# EasyEDA Pro project NI接口485_测试板子.eprj

# Schematic Schematic1
Create Date: 2023-08-04; Page Name: 接转接板; Project Name: NI接口485_测试板子; Schematic Name: Schematic1; Update Date: 2023-08-05; Company: 嘉立创EDA; Page Size: A4; Version: V1.0
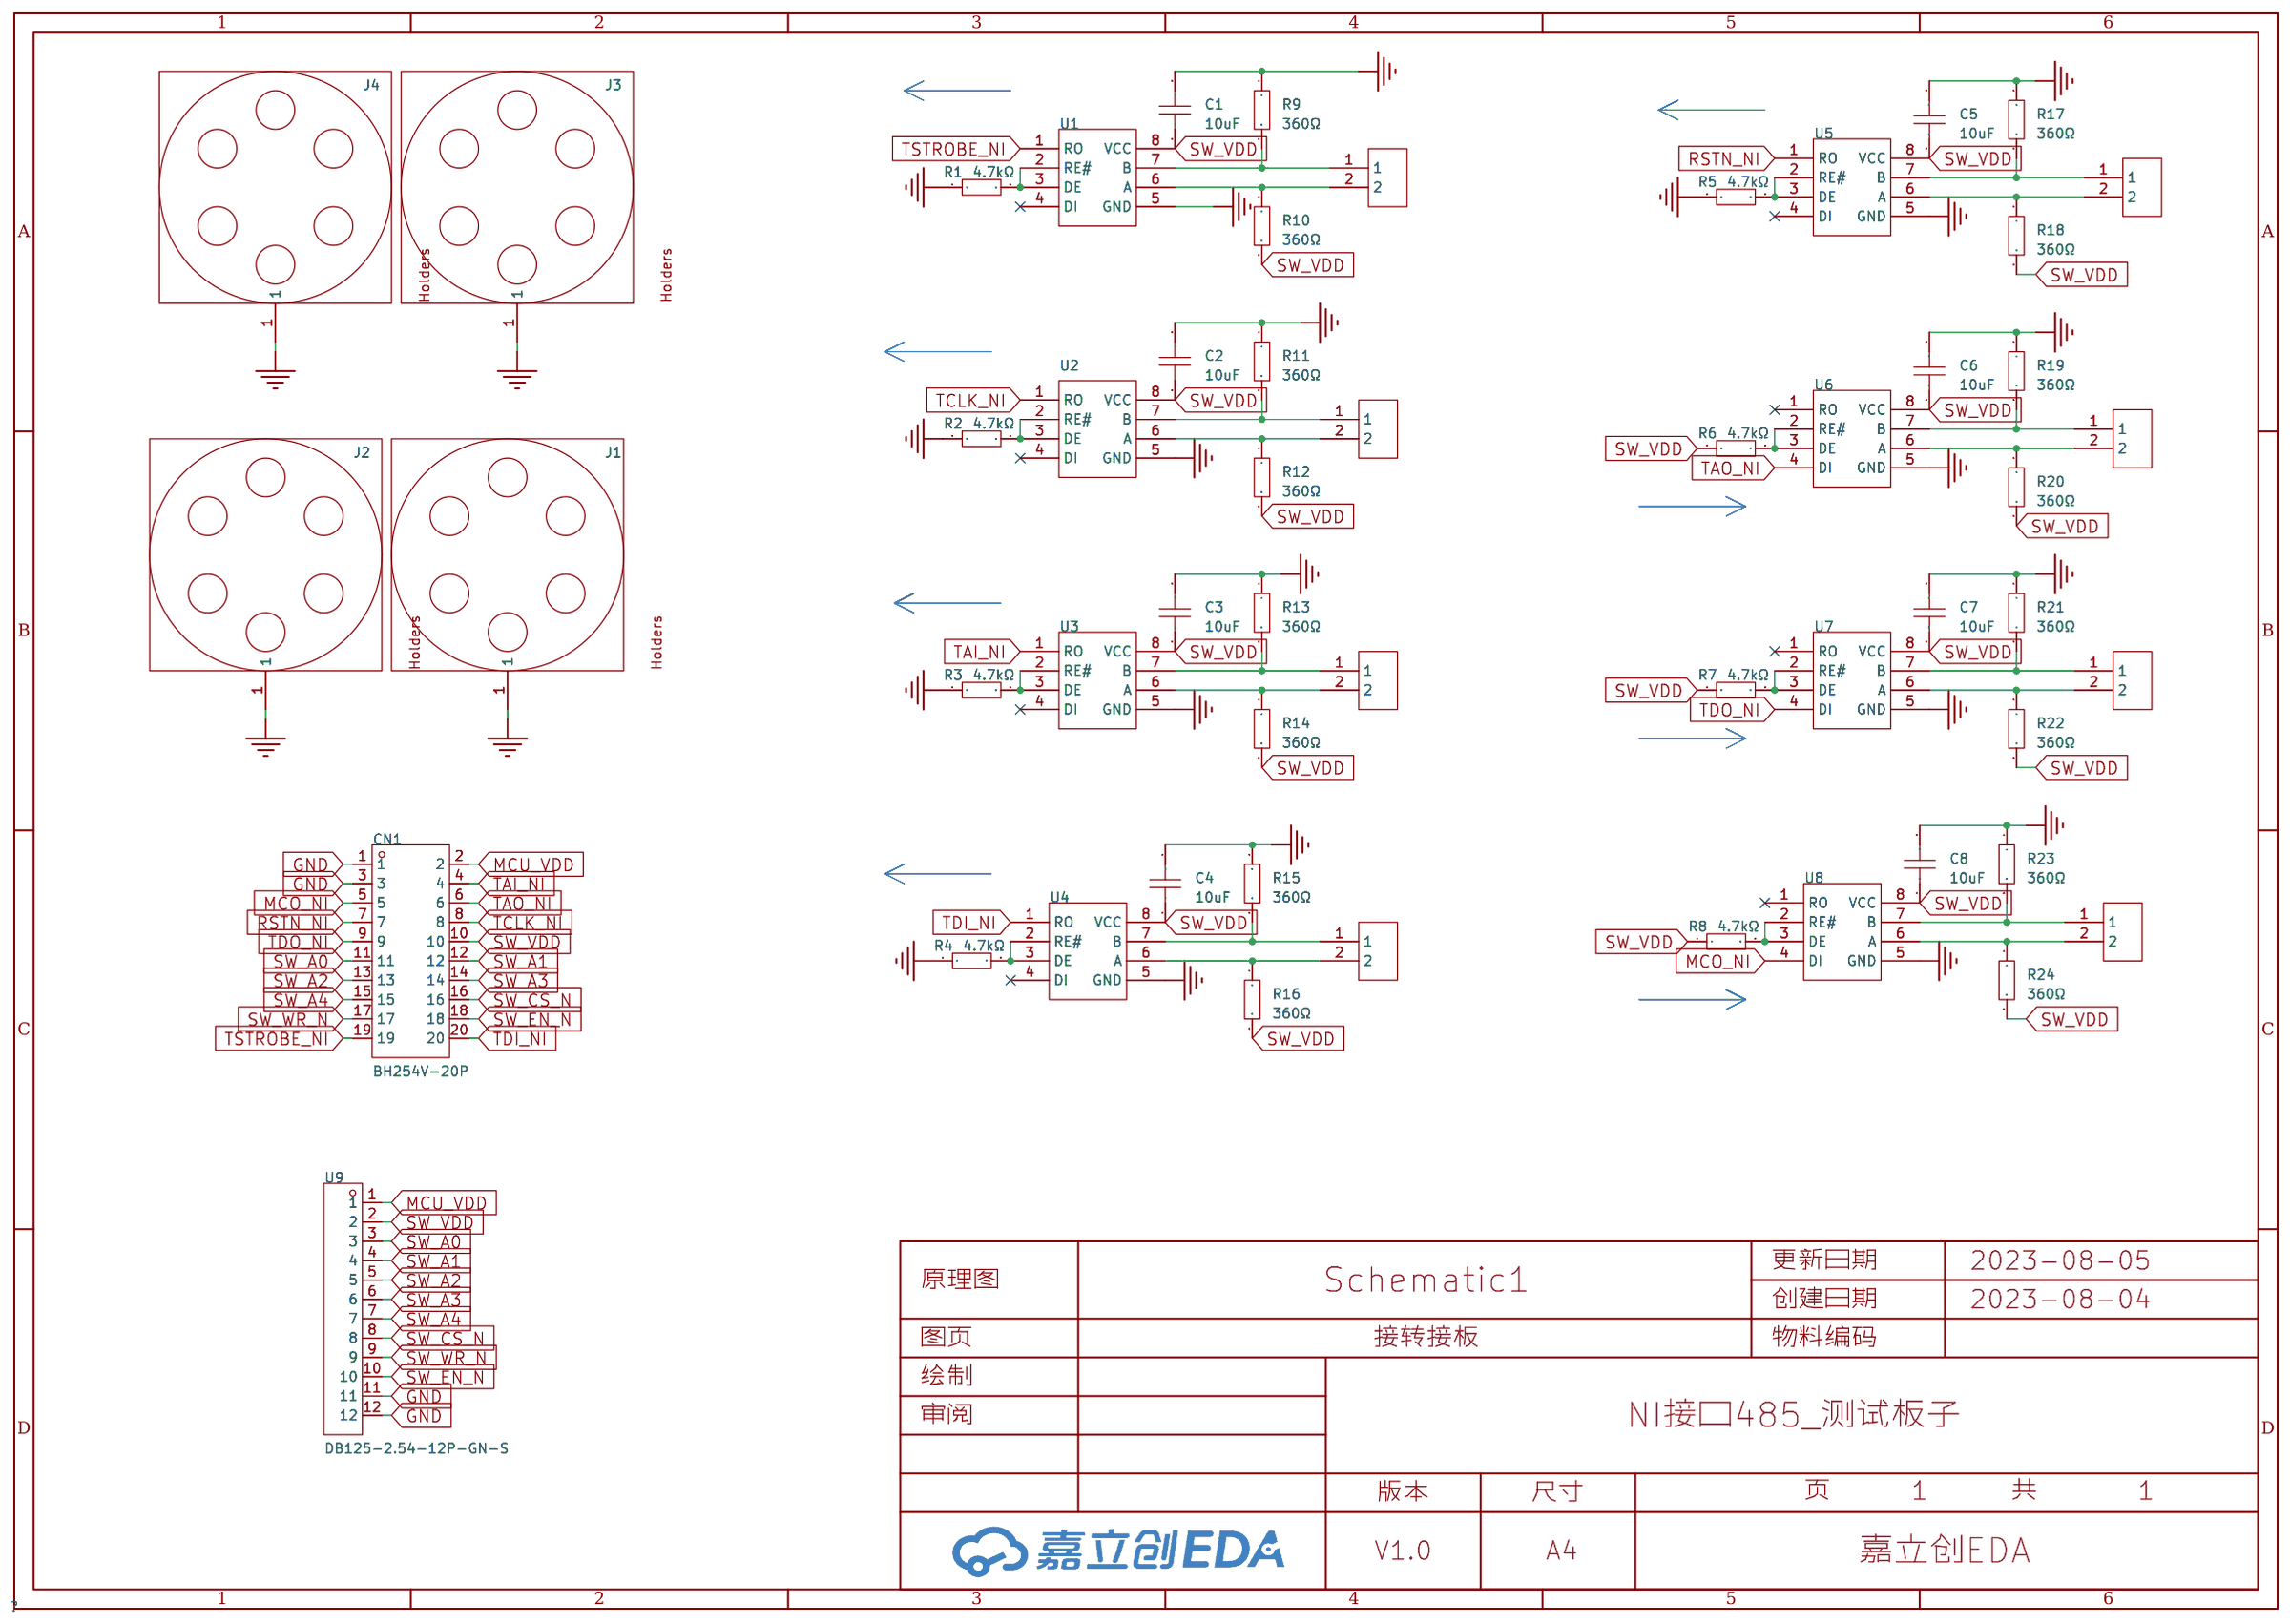
[diagram p0: schematic sheet]

## Parts
C1  10uF  [C0603]
C2  10uF  [C0603]
C3  10uF  [C0603]
C4  10uF  [C0603]
C5  10uF  [C0603]
C6  10uF  [C0603]
C7  10uF  [C0603]
C8  10uF  [C0603]
CN1  BH254V-20P  [CONN-TH_20P-P2.54_0702462001]
J1  -  [DEMO板安装孔]
J2  -  [DEMO板安装孔]
J3  -  [DEMO板安装孔]
J4  -  [DEMO板安装孔]
P1  WJ500V-5.08-2P  [CONN-TH_2P-P5.00_WJ500V-5.08-2P]
P2  WJ500V-5.08-2P  [CONN-TH_2P-P5.00_WJ500V-5.08-2P]
P3  WJ500V-5.08-2P  [CONN-TH_2P-P5.00_WJ500V-5.08-2P]
P4  WJ500V-5.08-2P  [CONN-TH_2P-P5.00_WJ500V-5.08-2P]
P5  WJ500V-5.08-2P  [CONN-TH_2P-P5.00_WJ500V-5.08-2P]
P6  WJ500V-5.08-2P  [CONN-TH_2P-P5.00_WJ500V-5.08-2P]
P7  WJ500V-5.08-2P  [CONN-TH_2P-P5.00_WJ500V-5.08-2P]
P8  WJ500V-5.08-2P  [CONN-TH_2P-P5.00_WJ500V-5.08-2P]
R1  4.7kΩ  [R0805]
R2  4.7kΩ  [R0805]
R3  4.7kΩ  [R0805]
R4  4.7kΩ  [R0805]
R5  4.7kΩ  [R0805]
R6  4.7kΩ  [R0805]
R7  4.7kΩ  [R0805]
R8  4.7kΩ  [R0805]
R9  360Ω  [R0603]
R10  360Ω  [R0603]
R11  360Ω  [R0603]
R12  360Ω  [R0603]
R13  360Ω  [R0603]
R14  360Ω  [R0603]
R15  360Ω  [R0603]
R16  360Ω  [R0603]
R17  360Ω  [R0603]
R18  360Ω  [R0603]
R19  360Ω  [R0603]
R20  360Ω  [R0603]
R21  360Ω  [R0603]
R22  360Ω  [R0603]
R23  360Ω  [R0603]
R24  360Ω  [R0603]
U1  SP485EEN-L/TR  [SOIC-8_L5.0-W4.0-P1.27-LS6.0-BL]
U2  SP485EEN-L/TR  [SOIC-8_L5.0-W4.0-P1.27-LS6.0-BL]
U3  SP485EEN-L/TR  [SOIC-8_L5.0-W4.0-P1.27-LS6.0-BL]
U4  SP485EEN-L/TR  [SOIC-8_L5.0-W4.0-P1.27-LS6.0-BL]
U5  SP485EEN-L/TR  [SOIC-8_L5.0-W4.0-P1.27-LS6.0-BL]
U6  SP485EEN-L/TR  [SOIC-8_L5.0-W4.0-P1.27-LS6.0-BL]
U7  SP485EEN-L/TR  [SOIC-8_L5.0-W4.0-P1.27-LS6.0-BL]
U8  SP485EEN-L/TR  [SOIC-8_L5.0-W4.0-P1.27-LS6.0-BL]
U9  DB125-2.54-12P-GN-S  [CONN-TH_DB125-2.54-12P-GN]

## Library data of the parts
C1-C8 = CL10A106KP8NNNC: 容值:10uF;精度:±10%;额定电压:10V;材质(温度系数):X5R;; LCSC Part Name: 10uF ±10% 10V; Supplier Part: C19702; Manufacturer: SAMSUNG(三星); Supplier Footprint: 0603; JLCPCB Part Class: Basic Part; Datasheet: https://atta.szlcsc.com/upload/public/pdf/source/20160103/1457707703378.pdf; Supplier: LCSC; Tolerance: ±10%; Voltage Rated: 10V; Temperature Coefficient: X5R
CN1 = BH254V-20P: 连接器类型:简牛座;每排PIN数:10;结构:2x10P;排数:2;间距:2.54mm;行距:2.54mm;封装形式:直插;额定电流:3A;额定电压:250V;工作温度范围:-40℃~+105℃;; LCSC Part Name: 每排P数:10 2x10P 排数:2 2.54mm; Supplier Part: C492444; Manufacturer: XFCN(兴飞); Supplier Footprint: 插件,P=2.54mm; JLCPCB Part Class: Extended Part; Datasheet: https://atta.szlcsc.com/upload/public/pdf/source/20200312/C492444_4AABE2FC4F6BE8226B85135616AF0092.pdf; Supplier: LCSC; Connector Type: 简牛座; Pin Number in each Row: 10; Structure: 2x10P; Number of Rows: 2; Pitch: 2.54mm; Row Spacing: 2.54mm; Holder Type: 直插; Current Rating (Max): 3A; Voltage Rating (Max): 250V; Operating Temperature Range: -40℃~+105℃
J1-J4 = 螺孔_3.1X6MM
P1-P8 = WJ500V-5.08-2P: 间距:5.08mm;结构:1x2P;排数:1;每排PIN数:2;安装方式:直针;额定电流:18A;额定电压:250V;线规 - AWG:14~30;线规 - mm2:2.5;工作温度范围:-40℃~+105℃;颜色:绿色;; LCSC Part Name: 5.08mm 1x2P 排数:1 每排P数:2 直针 可拼接; Supplier Part: C8465; Manufacturer: KANGNEX(康奈克斯电气); Supplier Footprint: 插件,P=5.08mm; JLCPCB Part Class: Extended Part; Datasheet: https://atta.szlcsc.com/upload/public/pdf/source/20191225/C8465_02D34CE5B5B4A53DF5891601D97FA9F4.pdf; Supplier: LCSC; Pitch: 5.08mm; Structure: 1x2P; Number of Rows: 1; Number of PINs Per Row: 2; Mounting Style: 直针; Current Rating (Max): 18A; Voltage Rating (Max): 250V; Wire Gauge - AWG: 14~30; Wire Gauge - mm2: 2.5; Operating Temperature Range: -40℃~+105℃; Color: 绿色
R1-R8 = 0805W8F4701T5E: 电阻类型:厚膜电阻;阻值:4.7kΩ;精度:±1%;功率:125mW;; LCSC Part Name: 4.7kΩ ±1% 125mW; Supplier Part: C17673; Manufacturer: UNI-ROYAL(厚声); Supplier Footprint: 0805; JLCPCB Part Class: Basic Part; Datasheet: https://atta.szlcsc.com/upload/public/pdf/source/20200306/C422600_1E6D84923E4A46A82E41ADD87F860B5C.pdf; Supplier: LCSC; Type: 厚膜电阻; Tolerance: ±1%; Power(Watts): 125mW; Temperature Coefficient: ±100ppm/℃; Overload Voltage (Max): 150V; Operating Temperature Range: -55℃~+155℃
R9-R24 = 0603WAF3600T5E: 电阻类型:厚膜电阻;阻值:360Ω;精度:±1%;功率:100mW;; LCSC Part Name: 360Ω ±1% 100mW; Supplier Part: C25194; Manufacturer: UNI-ROYAL(厚声); Supplier Footprint: 0603; JLCPCB Part Class: Basic Part; Datasheet: https://atta.szlcsc.com/upload/public/pdf/source/20200306/C422600_1E6D84923E4A46A82E41ADD87F860B5C.pdf; Supplier: LCSC; Type: 厚膜电阻; Tolerance: ±1%; Power(Watts): 100mW; Temperature Coefficient: ±100ppm/℃; Overload Voltage (Max): 75V; Operating Temperature Range: -55℃~+155℃
U1-U8 = SP485EEN-L/TR: 类型:收发器;驱动器/接收器:1/1;数据速率:10Mbps;; LCSC Part Name: 5V供电 10Mbps 收发器; Supplier Part: C6855; Manufacturer: MaxLinear; Supplier Footprint: SOIC-8; JLCPCB Part Class: Basic Part; Datasheet: https://atta.szlcsc.com/upload/public/pdf/source/20210125/C916163_66C97B5ACCC910994E8B10780F9BD300.pdf; Supplier: LCSC; Types: 收发器; Driver/receiver: 1/1; Data Rate: 10Mbps; Supply Voltage: 4.75V~5.25V
U9 = DB125-2.54-12P-GN-S: 间距:2.54mm;结构:1x12P;排数:1;每排PIN数:12;安装方式:直针;额定电流:8A;额定电压:130V;线规 - AWG:18~26;线规 - mm2:0.5~1;工作温度范围:-40℃~+105℃;颜色:绿色;; LCSC Part Name: 2.54mm 1x12P 排数:1 每排P数:12 直针; Supplier Part: C918129; Manufacturer: DIBO(地博电气); Supplier Footprint: 插件,P=2.54mm; JLCPCB Part Class: Extended Part; Datasheet: https://atta.szlcsc.com/upload/public/pdf/source/20230106/BCD3A0BE1EB95DC3E813F1745F022035.pdf; Supplier: LCSC; Pitch: 2.54mm; Structure: 1x12P; Number of Rows: 1; Number of PINs Per Row: 12; Mounting Style: 直针; Current Rating (Max): 8A; Voltage Rating (Max): 130V; Wire Gauge - AWG: 18~26; Wire Gauge - mm2: 0.5~1; Operating Temperature Range: -40℃~+105℃; Color: 绿色

## Nets
GND: C1.2 C2.2 C3.2 C4.2 C5.2 C6.2 C7.2 C8.2 CN1.1 CN1.3 J1.1 J2.1 J3.1 J4.1 R1.1 R2.1 R3.1 R4.1 R5.1 R9.1 R11.1 R13.1 R15.1 R17.1 R19.1 R21.1 R23.1 U1.5(GND) U2.5(GND) U3.5(GND) U4.5(GND) U5.5(GND) U6.5(GND) U7.5(GND) U8.5(GND) U9.11 U9.12
MCO_NI: CN1.5 U8.4(DI)
MCU_VDD: CN1.2 U9.1
RSTN_NI: CN1.7 U5.1(RO)
SW_A0: CN1.11 U9.3
SW_A1: CN1.12 U9.4
SW_A2: CN1.13 U9.5
SW_A3: CN1.14 U9.6
SW_A4: CN1.15 U9.7
SW_CS_N: CN1.16 U9.8
SW_EN_N: CN1.18 U9.10
SW_VDD: C1.1 C2.1 C3.1 C4.1 C5.1 C6.1 C7.1 C8.1 CN1.10 R6.1 R7.1 R8.1 R10.2 R12.2 R14.2 R16.2 R18.2 R20.2 R22.2 R24.2 U1.8(VCC) U2.8(VCC) U3.8(VCC) U4.8(VCC) U5.8(VCC) U6.8(VCC) U7.8(VCC) U8.8(VCC) U9.2
SW_WR_N: CN1.17 U9.9
TAI_NI: CN1.4 U3.1(RO)
TAO_NI: CN1.6 U6.4(DI)
TCLK_NI: CN1.8 U2.1(RO)
TDI_NI: CN1.20 U4.1(RO)
TDO_NI: CN1.9 U7.4(DI)
TSTROBE_NI: CN1.19 U1.1(RO)
$1N832: R1.2 U1.2(RE#) U1.3(DE)
$1N836: R2.2 U2.2(RE#) U2.3(DE)
$1N843: R3.2 U3.2(RE#) U3.3(DE)
$1N857: R4.2 U4.2(RE#) U4.3(DE)
$1N862: R5.2 U5.2(RE#) U5.3(DE)
$1N867: R6.2 U6.2(RE#) U6.3(DE)
$1N875: R7.2 U7.2(RE#) U7.3(DE)
$1N1426: P1.2 R10.1 U1.6(A)
$1N1466: P5.2 R18.1 U5.6(A)
$1N1479: P6.2 R20.1 U6.6(A)
$1N1489: P7.2 R22.1 U7.6(A)
$1N1503: P8.2 R24.1 U8.6(A)
$1N2683: R8.2 U8.2(RE#) U8.3(DE)
$1N7494: P1.1 R9.2 U1.7(B)
$1N7701: P2.2 R12.1 U2.6(A)
$1N7808: P2.1 R11.2 U2.7(B)
$1N7842: P3.2 R14.1 U3.6(A)
$1N7943: P3.1 R13.2 U3.7(B)
$1N8036: P4.2 R16.1 U4.6(A)
$1N8041: P4.1 R15.2 U4.7(B)
$1N8826: P5.1 R17.2 U5.7(B)
$1N9060: P7.1 R21.2 U7.7(B)
$1N9174: P8.1 R23.2 U8.7(B)
$1N9186: P6.1 R19.2 U6.7(B)

Not connected (* = marked no-connect by the designer): U1 4(DI)*; U2 4(DI)*; U3 4(DI)*; U4 4(DI)*; U5 4(DI)*; U6 1(RO)*; U7 1(RO)*; U8 1(RO)*

# Schematic Schematic2
Create Date: 2023-08-04; Page Name: 接NI; Project Name: NI接口485_测试板子; Schematic Name: Schematic2; Update Date: 2023-08-05; Company: 嘉立创EDA; Page Size: A4; Version: V1.0
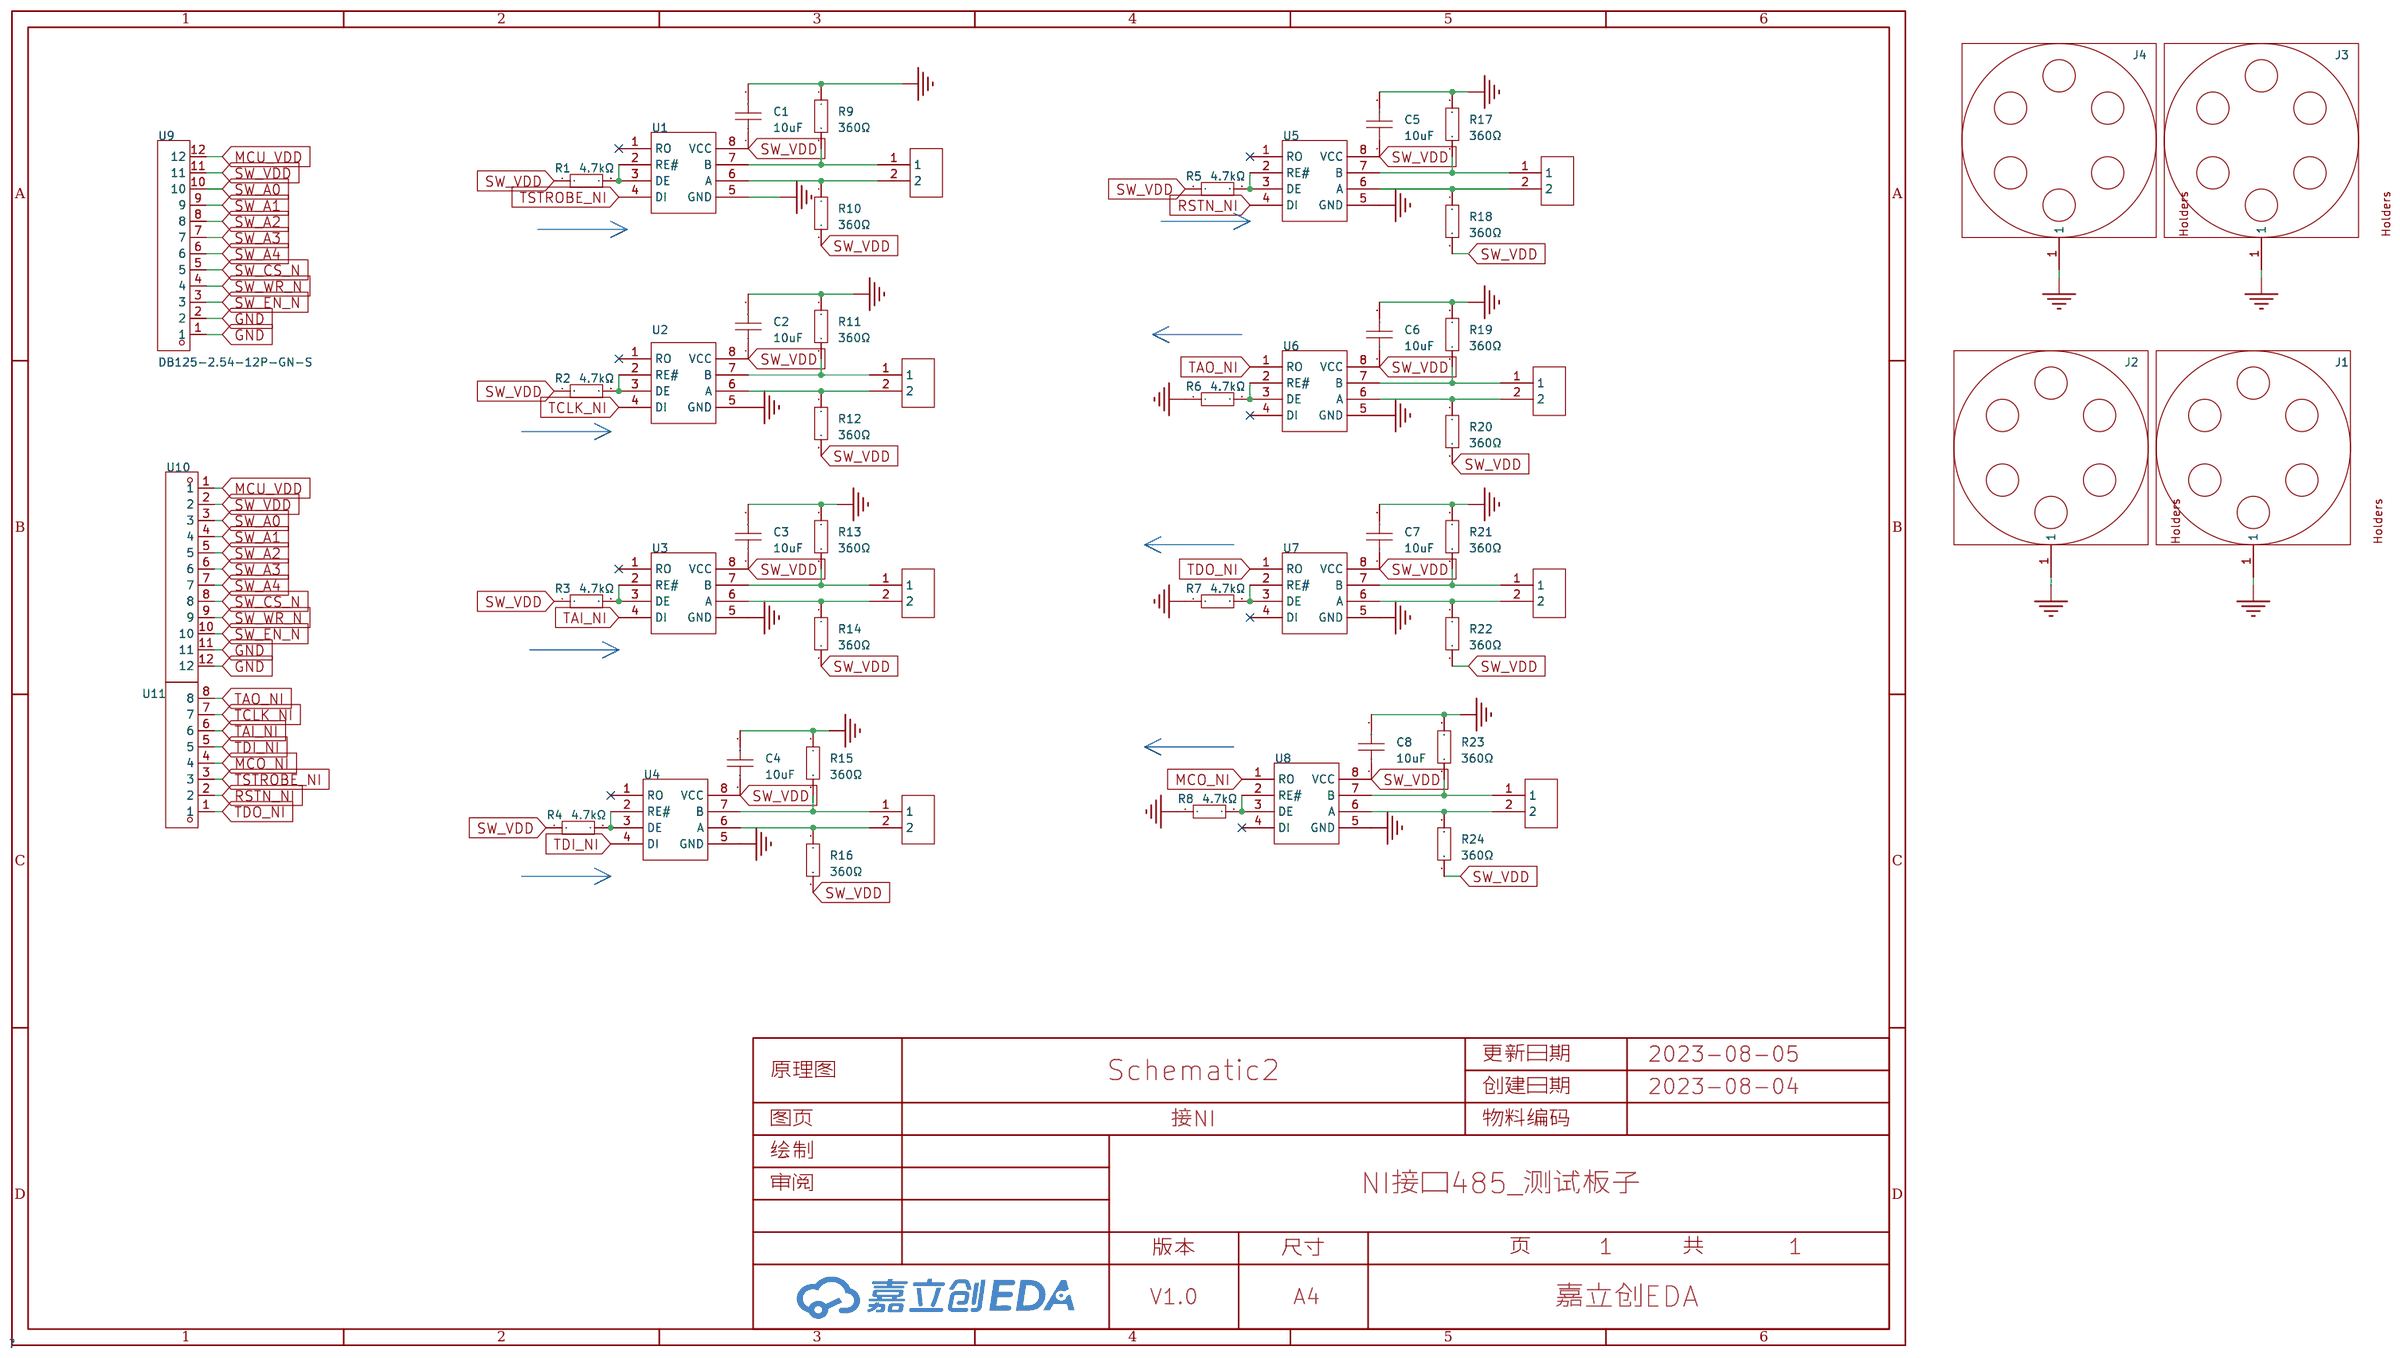
[diagram p1: schematic sheet]

## Parts
C1  10uF  [C0603]
C2  10uF  [C0603]
C3  10uF  [C0603]
C4  10uF  [C0603]
C5  10uF  [C0603]
C6  10uF  [C0603]
C7  10uF  [C0603]
C8  10uF  [C0603]
J1  -  [DEMO板安装孔]
J2  -  [DEMO板安装孔]
J3  -  [DEMO板安装孔]
J4  -  [DEMO板安装孔]
P1  WJ500V-5.08-2P  [CONN-TH_2P-P5.00_WJ500V-5.08-2P]
P2  WJ500V-5.08-2P  [CONN-TH_2P-P5.00_WJ500V-5.08-2P]
P3  WJ500V-5.08-2P  [CONN-TH_2P-P5.00_WJ500V-5.08-2P]
P4  WJ500V-5.08-2P  [CONN-TH_2P-P5.00_WJ500V-5.08-2P]
P5  WJ500V-5.08-2P  [CONN-TH_2P-P5.00_WJ500V-5.08-2P]
P6  WJ500V-5.08-2P  [CONN-TH_2P-P5.00_WJ500V-5.08-2P]
P7  WJ500V-5.08-2P  [CONN-TH_2P-P5.00_WJ500V-5.08-2P]
P8  WJ500V-5.08-2P  [CONN-TH_2P-P5.00_WJ500V-5.08-2P]
R1  4.7kΩ  [R0805]
R2  4.7kΩ  [R0805]
R3  4.7kΩ  [R0805]
R4  4.7kΩ  [R0805]
R5  4.7kΩ  [R0805]
R6  4.7kΩ  [R0805]
R7  4.7kΩ  [R0805]
R8  4.7kΩ  [R0805]
R9  360Ω  [R0603]
R10  360Ω  [R0603]
R11  360Ω  [R0603]
R12  360Ω  [R0603]
R13  360Ω  [R0603]
R14  360Ω  [R0603]
R15  360Ω  [R0603]
R16  360Ω  [R0603]
R17  360Ω  [R0603]
R18  360Ω  [R0603]
R19  360Ω  [R0603]
R20  360Ω  [R0603]
R21  360Ω  [R0603]
R22  360Ω  [R0603]
R23  360Ω  [R0603]
R24  360Ω  [R0603]
U1  SP485EEN-L/TR  [SOIC-8_L5.0-W4.0-P1.27-LS6.0-BL]
U2  SP485EEN-L/TR  [SOIC-8_L5.0-W4.0-P1.27-LS6.0-BL]
U3  SP485EEN-L/TR  [SOIC-8_L5.0-W4.0-P1.27-LS6.0-BL]
U4  SP485EEN-L/TR  [SOIC-8_L5.0-W4.0-P1.27-LS6.0-BL]
U5  SP485EEN-L/TR  [SOIC-8_L5.0-W4.0-P1.27-LS6.0-BL]
U6  SP485EEN-L/TR  [SOIC-8_L5.0-W4.0-P1.27-LS6.0-BL]
U7  SP485EEN-L/TR  [SOIC-8_L5.0-W4.0-P1.27-LS6.0-BL]
U8  SP485EEN-L/TR  [SOIC-8_L5.0-W4.0-P1.27-LS6.0-BL]
U9  DB125-2.54-12P-GN-S  [CONN-TH_DB125-2.54-12P-GN]
U10  DB125-2.54-12P-GN-S  [CONN-TH_DB125-2.54-12P-GN]
U11  DB125-2.54-8P-GN-S  [CONN-TH_DB125-2.54-8P-GN]

## Library data of the parts
C1-C8 = CL10A106KP8NNNC: 容值:10uF;精度:±10%;额定电压:10V;材质(温度系数):X5R;; LCSC Part Name: 10uF ±10% 10V; Supplier Part: C19702; Manufacturer: SAMSUNG(三星); Supplier Footprint: 0603; JLCPCB Part Class: Basic Part; Datasheet: https://atta.szlcsc.com/upload/public/pdf/source/20160103/1457707703378.pdf; Supplier: LCSC; Tolerance: ±10%; Voltage Rated: 10V; Temperature Coefficient: X5R
J1-J4 = 螺孔_3.1X6MM
P1-P8 = WJ500V-5.08-2P: 间距:5.08mm;结构:1x2P;排数:1;每排PIN数:2;安装方式:直针;额定电流:18A;额定电压:250V;线规 - AWG:14~30;线规 - mm2:2.5;工作温度范围:-40℃~+105℃;颜色:绿色;; LCSC Part Name: 5.08mm 1x2P 排数:1 每排P数:2 直针 可拼接; Supplier Part: C8465; Manufacturer: KANGNEX(康奈克斯电气); Supplier Footprint: 插件,P=5.08mm; JLCPCB Part Class: Extended Part; Datasheet: https://atta.szlcsc.com/upload/public/pdf/source/20191225/C8465_02D34CE5B5B4A53DF5891601D97FA9F4.pdf; Supplier: LCSC; Pitch: 5.08mm; Structure: 1x2P; Number of Rows: 1; Number of PINs Per Row: 2; Mounting Style: 直针; Current Rating (Max): 18A; Voltage Rating (Max): 250V; Wire Gauge - AWG: 14~30; Wire Gauge - mm2: 2.5; Operating Temperature Range: -40℃~+105℃; Color: 绿色
R1-R8 = 0805W8F4701T5E: 电阻类型:厚膜电阻;阻值:4.7kΩ;精度:±1%;功率:125mW;; LCSC Part Name: 4.7kΩ ±1% 125mW; Supplier Part: C17673; Manufacturer: UNI-ROYAL(厚声); Supplier Footprint: 0805; JLCPCB Part Class: Basic Part; Datasheet: https://atta.szlcsc.com/upload/public/pdf/source/20200306/C422600_1E6D84923E4A46A82E41ADD87F860B5C.pdf; Supplier: LCSC; Type: 厚膜电阻; Tolerance: ±1%; Power(Watts): 125mW; Temperature Coefficient: ±100ppm/℃; Overload Voltage (Max): 150V; Operating Temperature Range: -55℃~+155℃
R9-R24 = 0603WAF3600T5E: 电阻类型:厚膜电阻;阻值:360Ω;精度:±1%;功率:100mW;; LCSC Part Name: 360Ω ±1% 100mW; Supplier Part: C25194; Manufacturer: UNI-ROYAL(厚声); Supplier Footprint: 0603; JLCPCB Part Class: Basic Part; Datasheet: https://atta.szlcsc.com/upload/public/pdf/source/20200306/C422600_1E6D84923E4A46A82E41ADD87F860B5C.pdf; Supplier: LCSC; Type: 厚膜电阻; Tolerance: ±1%; Power(Watts): 100mW; Temperature Coefficient: ±100ppm/℃; Overload Voltage (Max): 75V; Operating Temperature Range: -55℃~+155℃
U1-U8 = SP485EEN-L/TR: 类型:收发器;驱动器/接收器:1/1;数据速率:10Mbps;; LCSC Part Name: 5V供电 10Mbps 收发器; Supplier Part: C6855; Manufacturer: MaxLinear; Supplier Footprint: SOIC-8; JLCPCB Part Class: Basic Part; Datasheet: https://atta.szlcsc.com/upload/public/pdf/source/20210125/C916163_66C97B5ACCC910994E8B10780F9BD300.pdf; Supplier: LCSC; Types: 收发器; Driver/receiver: 1/1; Data Rate: 10Mbps; Supply Voltage: 4.75V~5.25V
U9 U10 = DB125-2.54-12P-GN-S: 间距:2.54mm;结构:1x12P;排数:1;每排PIN数:12;安装方式:直针;额定电流:8A;额定电压:130V;线规 - AWG:18~26;线规 - mm2:0.5~1;工作温度范围:-40℃~+105℃;颜色:绿色;; LCSC Part Name: 2.54mm 1x12P 排数:1 每排P数:12 直针; Supplier Part: C918129; Manufacturer: DIBO(地博电气); Supplier Footprint: 插件,P=2.54mm; JLCPCB Part Class: Extended Part; Datasheet: https://atta.szlcsc.com/upload/public/pdf/source/20230106/BCD3A0BE1EB95DC3E813F1745F022035.pdf; Supplier: LCSC; Pitch: 2.54mm; Structure: 1x12P; Number of Rows: 1; Number of PINs Per Row: 12; Mounting Style: 直针; Current Rating (Max): 8A; Voltage Rating (Max): 130V; Wire Gauge - AWG: 18~26; Wire Gauge - mm2: 0.5~1; Operating Temperature Range: -40℃~+105℃; Color: 绿色
U11 = DB125-2.54-8P-GN-S: 间距:2.54mm;排数:1;每排PIN数:8;安装方式:直针;额定电流:8A;额定电压:130V;线规 - AWG:18~26;线规 - mm?:0.5~1;工作温度范围:-40℃~+105℃;颜色:绿色;; LCSC Part Name: 2.54mm 排数:1 每排P数:8 直针; Supplier Part: C918126; Manufacturer: DIBO(地博电气); Supplier Footprint: 直插,P=2.54mm; JLCPCB Part Class: Extended Part; Datasheet: https://atta.szlcsc.com/upload/public/pdf/source/20201111/C918120_C9DB7F6F3DB366529A80D61CABEEDAE6.pdf; Supplier: LCSC; Pitch: 2.54mm; Number of Rows: 1; Number of PINs Per Row: 8; Mounting Style: 直针; Current Rating (Max): 8A; Voltage Rating (Max): 130V; Wire Gauge - AWG: 18~26; Wire Gauge - mm?: 0.5~1; Operating Temperature Range: -40℃~+105℃; Color: 绿色

## Nets
GND: C1.2 C2.2 C3.2 C4.2 C5.2 C6.2 C7.2 C8.2 J1.1 J2.1 J3.1 J4.1 R6.1 R7.1 R8.1 R9.1 R11.1 R13.1 R15.1 R17.1 R19.1 R21.1 R23.1 U1.5(GND) U2.5(GND) U3.5(GND) U4.5(GND) U5.5(GND) U6.5(GND) U7.5(GND) U8.5(GND) U9.1 U9.2 U10.11 U10.12
MCO_NI: U8.1(RO) U11.4
MCU_VDD: U9.12 U10.1
RSTN_NI: U5.4(DI) U11.2
SW_A0: U9.10 U10.3
SW_A1: U9.9 U10.4
SW_A2: U9.8 U10.5
SW_A3: U9.7 U10.6
SW_A4: U9.6 U10.7
SW_CS_N: U9.5 U10.8
SW_EN_N: U9.3 U10.10
SW_VDD: C1.1 C2.1 C3.1 C4.1 C5.1 C6.1 C7.1 C8.1 R1.1 R2.1 R3.1 R4.1 R5.1 R10.2 R12.2 R14.2 R16.2 R18.2 R20.2 R22.2 R24.2 U1.8(VCC) U2.8(VCC) U3.8(VCC) U4.8(VCC) U5.8(VCC) U6.8(VCC) U7.8(VCC) U8.8(VCC) U9.11 U10.2
SW_WR_N: U9.4 U10.9
TAI_NI: U3.4(DI) U11.6
TAO_NI: U6.1(RO) U11.8
TCLK_NI: U2.4(DI) U11.7
TDI_NI: U4.4(DI) U11.5
TDO_NI: U7.1(RO) U11.1
TSTROBE_NI: U1.4(DI) U11.3
$1N12065: R1.2 U1.2(RE#) U1.3(DE)
$1N12066: R2.2 U2.2(RE#) U2.3(DE)
$1N12067: R3.2 U3.2(RE#) U3.3(DE)
$1N12068: R4.2 U4.2(RE#) U4.3(DE)
$1N12069: R6.2 U6.2(RE#) U6.3(DE)
$1N12070: R7.2 U7.2(RE#) U7.3(DE)
$1N12071: P6.2 R20.1 U6.6(A)
$1N12074: P7.2 R22.1 U7.6(A)
$1N12077: P8.2 R24.1 U8.6(A)
$1N12080: R8.2 U8.2(RE#) U8.3(DE)
$1N12109: P1.1 R9.2 U1.7(B)
$1N12117: P1.2 R10.1 U1.6(A)
$1N12129: P2.2 R12.1 U2.6(A)
$1N12137: P2.1 R11.2 U2.7(B)
$1N12145: P3.2 R14.1 U3.6(A)
$1N12153: P3.1 R13.2 U3.7(B)
$1N12161: P5.2 R18.1 U5.6(A)
$1N12164: R5.2 U5.2(RE#) U5.3(DE)
$1N12169: P4.2 R16.1 U4.6(A)
$1N12172: P4.1 R15.2 U4.7(B)
$1N12187: P5.1 R17.2 U5.7(B)
$1N12210: P7.1 R21.2 U7.7(B)
$1N12222: P8.1 R23.2 U8.7(B)
$1N12229: P6.1 R19.2 U6.7(B)

Not connected (* = marked no-connect by the designer): U1 1(RO)*; U2 1(RO)*; U3 1(RO)*; U4 1(RO)*; U5 1(RO)*; U6 4(DI)*; U7 4(DI)*; U8 4(DI)*

# Board PCB1
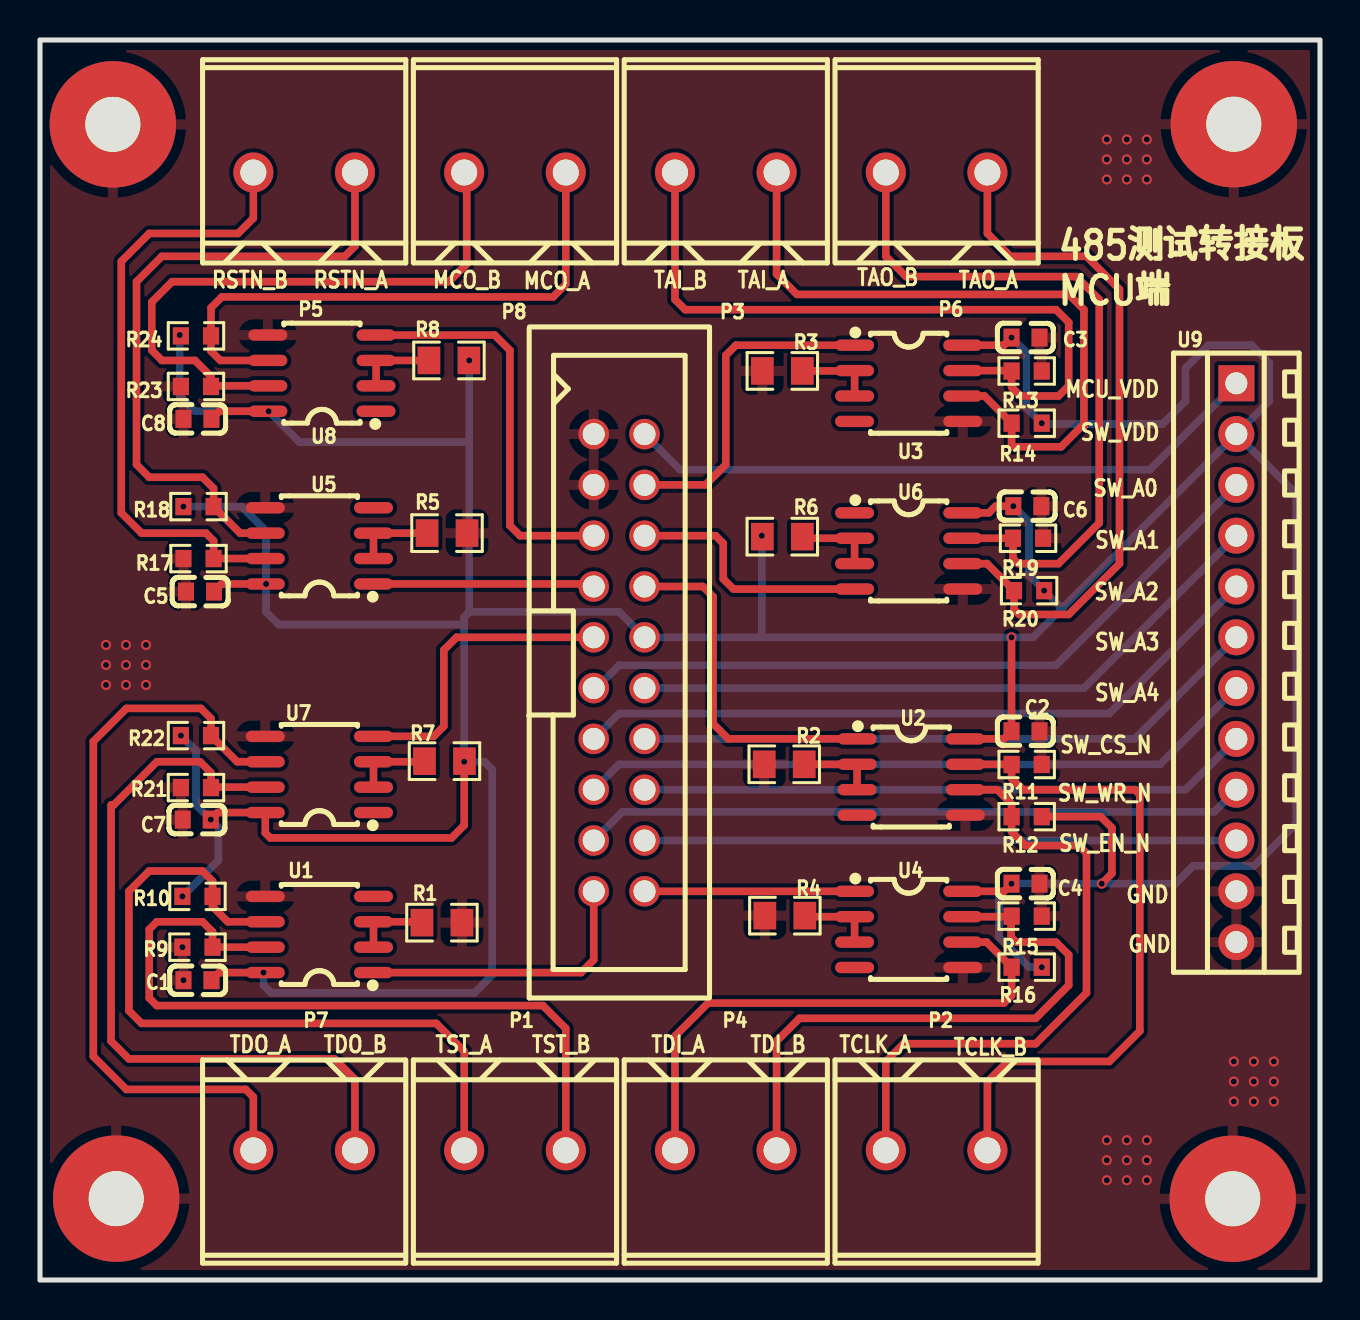
[diagram p2: board, top side]
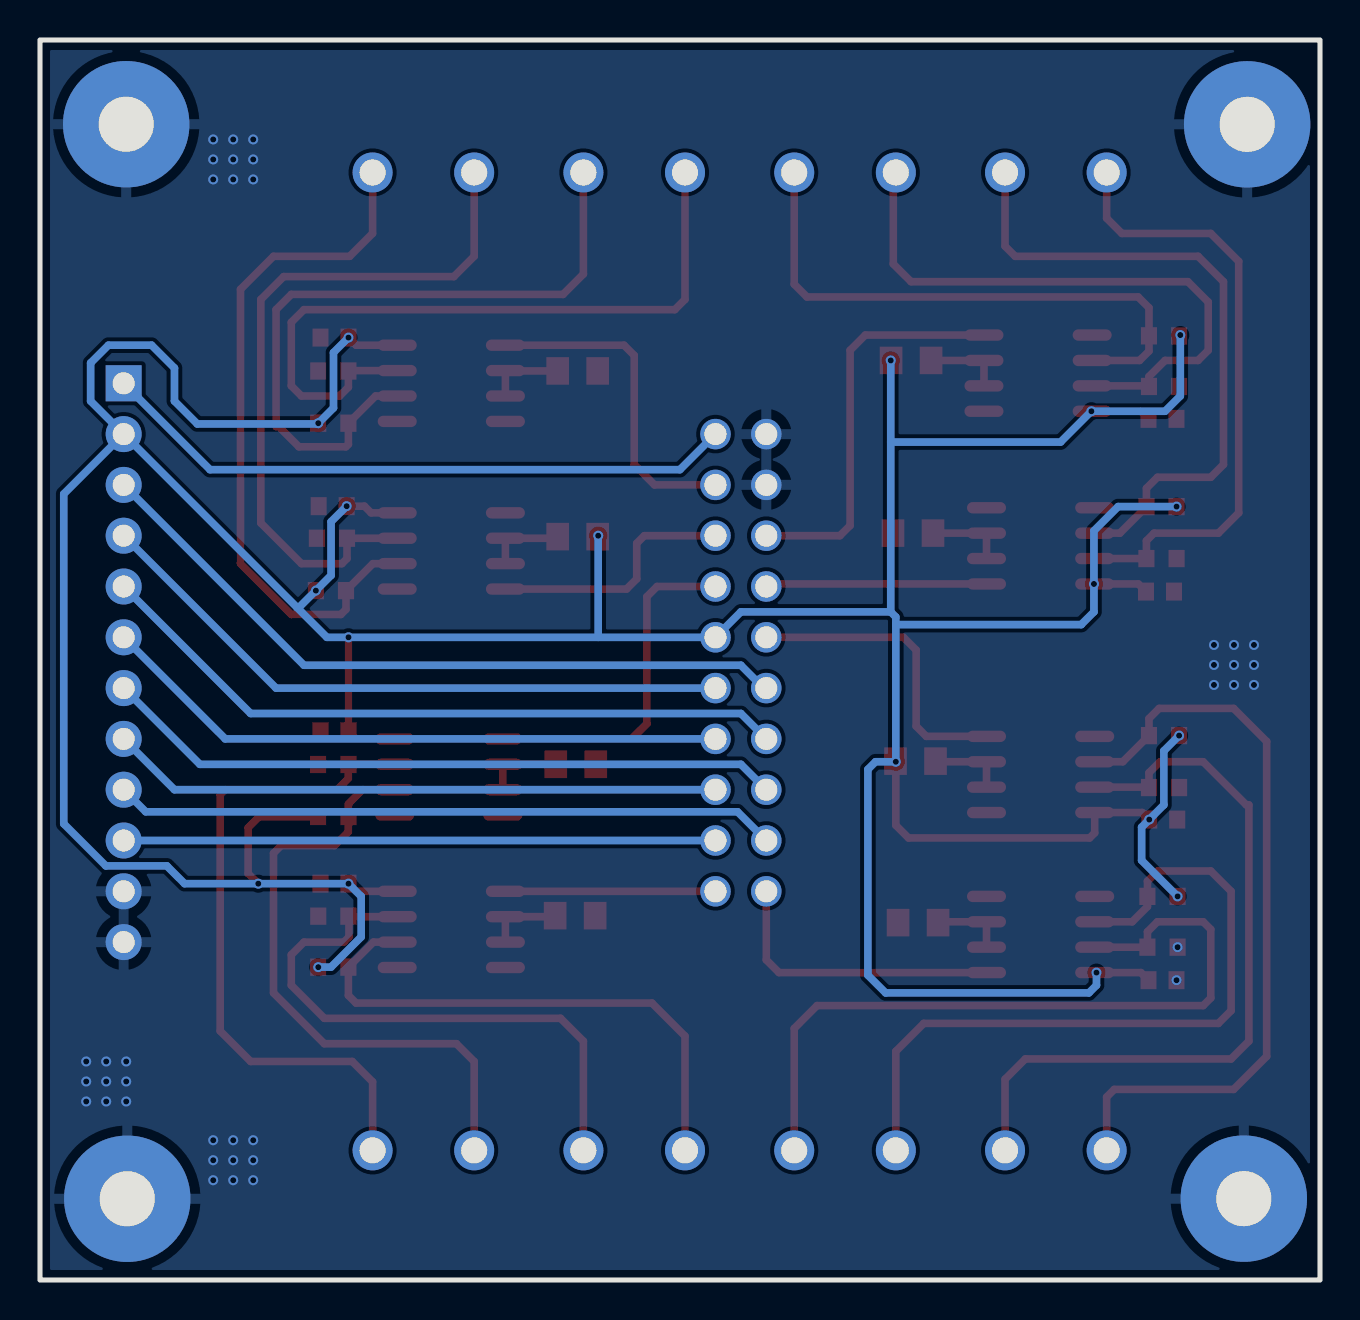
[diagram p3: board, bottom side, seen from below]

Outline 64 x 62 mm; copper layers: Top Layer, Bottom Layer. Coordinates in mm from the lower left corner of the outline.
Outline path: rectangle 0,62 64,0
Stack: Top Layer 0.035mm / Dielectric1 1.51mm FR4 er 4.5 / Bottom Layer 0.035mm

## Design rules (mm)
template: 自定义配置
spacing copperThickness1oz (default): track to track 0.102, other pairs 0.152 to 0.3
spacing copperThickness2oz: track to track 0.203, other pairs 0.152 to 0.3
track width copperThickness1oz (default): min 0.127, default 0.254, max 2.54
track width copperThickness2oz: min 0.203, default 0.254, max 2.54
differential pair differentialPair (default): width min 0.127, default 0.254, max 2.54; gap min 0.152, default 0.152
via viaSize (default): diameter min 0.5, default 0.61, max 10; hole min 0.3, default 0.305, max 6.3

## Placement (name value [footprint] x y rotation side)
C1  10uF  [C0603]  7.87 14.99 180 top
C2  10uF  [C0603]  49.28 27.44 0 top
C3  10uF  [C0603]  49.28 47.12 0 top
C4  10uF  [C0603]  49.28 19.82 0 top
C5  10uF  [C0603]  8 34.42 180 top
C6  10uF  [C0603]  49.37 38.69 0 top
C7  10uF  [C0603]  7.84 23.02 180 top
C8  10uF  [C0603]  7.87 43.06 180 top
CN1  BH254V-20P  [CONN-TH_20P-P2.54_0702462001]  28.96 30.87 270 top
J1  -  [demo板安装孔]  59.64 4.06 0 top
J2  -  [demo板安装孔]  3.81 4.07 0 top
J3  -  [demo板安装孔]  59.69 57.79 0 top
J4  -  [demo板安装孔]  3.64 57.78 0 top
P1  WJ500V-5.08-2P  [CONN-TH_2P-P5.00_WJ500V-5.08-2P]  23.75 6.48 180 top
P2  WJ500V-5.08-2P  [CONN-TH_2P-P5.00_WJ500V-5.08-2P]  44.83 6.48 180 top
P3  WJ500V-5.08-2P  [CONN-TH_2P-P5.00_WJ500V-5.08-2P]  34.29 55.38 0 top
P4  WJ500V-5.08-2P  [CONN-TH_2P-P5.00_WJ500V-5.08-2P]  34.29 6.48 180 top
P5  WJ500V-5.08-2P  [CONN-TH_2P-P5.00_WJ500V-5.08-2P]  13.21 55.38 0 top
P6  WJ500V-5.08-2P  [CONN-TH_2P-P5.00_WJ500V-5.08-2P]  44.83 55.38 0 top
P7  WJ500V-5.08-2P  [CONN-TH_2P-P5.00_WJ500V-5.08-2P]  13.21 6.48 180 top
P8  WJ500V-5.08-2P  [CONN-TH_2P-P5.00_WJ500V-5.08-2P]  23.75 55.38 0 top
R1  4.7kΩ  [R0805]  20.1 17.87 180 top
R2  4.7kΩ  [R0805]  37.21 25.79 0 top
R3  4.7kΩ  [R0805]  37.12 45.45 0 top
R4  4.7kΩ  [R0805]  37.24 18.22 0 top
R5  4.7kΩ  [R0805]  20.35 37.34 180 top
R6  4.7kΩ  [R0805]  37.12 37.17 0 top
R7  4.7kΩ  [R0805]  20.22 25.94 180 top
R8  4.7kΩ  [R0805]  20.45 45.98 180 top
R9  360Ω  [R0603]  7.87 16.64 0 top
R10  360Ω  [R0603]  7.87 19.18 180 top
R11  360Ω  [R0603]  49.33 25.77 180 top
R12  360Ω  [R0603]  49.33 23.17 0 top
R13  360Ω  [R0603]  49.33 45.45 180 top
R14  360Ω  [R0603]  49.33 42.84 0 top
R15  360Ω  [R0603]  49.33 18.19 180 top
R16  360Ω  [R0603]  49.33 15.64 0 top
R17  360Ω  [R0603]  7.93 36.07 0 top
R18  360Ω  [R0603]  7.93 38.67 180 top
R19  360Ω  [R0603]  49.4 37.09 180 top
R20  360Ω  [R0603]  49.45 34.47 0 top
R21  360Ω  [R0603]  7.8 24.62 0 top
R22  360Ω  [R0603]  7.8 27.22 180 top
R23  360Ω  [R0603]  7.8 44.68 0 top
R24  360Ω  [R0603]  7.8 47.21 180 top
U1  SP485EEN-L/TR  [SOIC-8_L5.0-W4.0-P1.27-LS6.0-BL]  13.97 17.28 90 top
U2  SP485EEN-L/TR  [SOIC-8_L5.0-W4.0-P1.27-LS6.0-BL]  43.56 25.15 270 top
U3  SP485EEN-L/TR  [SOIC-8_L5.0-W4.0-P1.27-LS6.0-BL]  43.43 44.84 270 top
U4  SP485EEN-L/TR  [SOIC-8_L5.0-W4.0-P1.27-LS6.0-BL]  43.43 17.53 270 top
U5  SP485EEN-L/TR  [SOIC-8_L5.0-W4.0-P1.27-LS6.0-BL]  13.97 36.71 90 top
U6  SP485EEN-L/TR  [SOIC-8_L5.0-W4.0-P1.27-LS6.0-BL]  43.43 36.45 270 top
U7  SP485EEN-L/TR  [SOIC-8_L5.0-W4.0-P1.27-LS6.0-BL]  13.97 25.28 90 top
U8  SP485EEN-L/TR  [SOIC-8_L5.0-W4.0-P1.27-LS6.0-BL]  14.1 45.34 90 top
U9  DB125-2.54-12P-GN-S  [CONN-TH_DB125-2.54-12P-GN]  59.82 30.87 270 top

## Footprints (pads in the part's own frame, mm; a bottom-side part is the same pattern mirrored in y, then rotated)
C0603
  rect 0.8x0.9 smd: 1(-0.7,0) 2(0.7,0)
CONN-TH_2P-P5.00_WJ500V-5.08-2P
  round 2 hole 1.3: 1(-2.54,0) 2(2.54,0)
CONN-TH_20P-P2.54_0702462001
  round 1.524 hole 1.1: 1(-11.43,-1.27) 2(-11.43,1.27) 3(-8.89,-1.27) 4(-8.89,1.27) 5(-6.35,-1.27) 6(-6.35,1.27) 7(-3.81,-1.27) 8(-3.81,1.27) 9(-1.27,-1.27) 10(-1.27,1.27) 11(1.27,-1.27) 12(1.27,1.27) 13(3.81,-1.27) 14(3.81,1.27) 15(6.35,-1.27) 16(6.35,1.27) 17(8.89,-1.27) 18(8.89,1.27) 19(11.43,-1.27) 20(11.43,1.27)
CONN-TH_DB125-2.54-12P-GN
  rect 1.8x1.8 hole 1.1: 1(-13.97,0)
  round 1.8 hole 1.1: 2(-11.43,0) 3(-8.89,0) 4(-6.35,0) 5(-3.81,0) 6(-1.27,0) 7(1.27,0) 8(3.81,0) 9(6.35,0) 10(8.89,0) 11(11.43,0) 12(13.97,0)
demo板安装孔
  round 6.32 hole 2.75: 1(0,0)
R0603
  rect 0.806x0.864 smd: 1(-0.753,0) 2(0.753,0)
R0805
  rect 1.133x1.377 smd: 1(-1,0) 2(1,0)
SOIC-8_L5.0-W4.0-P1.27-LS6.0-BL
  oval 0.569x1.95 smd: 1(-1.905,-2.705) 2(-0.635,-2.705) 3(0.635,-2.705) 4(1.905,-2.705) 5(1.905,2.705) 6(0.635,2.705) 7(-0.635,2.705) 8(-1.905,2.705)

## Nets
As in the schematic.

Pads without a net: U1 4; U2 4; U3 4; U4 4; U5 4; U6 1; U7 1; U8 1

## Via types
v1: diameter 0.5, hole 0.305, Top Layer to Bottom Layer, 57 vias

## Routing (per net, layer and track width the routed paths; a pad name or vN(x,y) marks a point on that pad's centre or on a via; arc(x,y) is an arc through that point)
GND:
  vias: v1(3.3,31.75) v1(3.3,30.75) v1(3.3,29.75) v1(4.3,31.75) v1(4.3,30.75) v1(4.3,29.75) v1(5.3,31.75) v1(5.3,30.75) v1(5.3,29.75) v1(7.12,16.64) v1(7.17,14.99) v1(53.34,57.03) v1(53.34,56.03) v1(53.34,55.03) v1(53.34,6.99) v1(53.34,5.99) v1(53.34,4.99) v1(54.34,57.03) v1(54.34,56.03) v1(54.34,55.03) v1(54.34,6.99) v1(54.34,5.99) v1(54.34,4.99) v1(55.34,57.03) v1(55.34,56.03) v1(55.34,55.03) v1(55.34,6.99) v1(55.34,5.99) v1(55.34,4.99) v1(59.69,10.93) v1(59.69,9.93) v1(59.69,8.93) v1(60.69,10.93) v1(60.69,9.93) v1(60.69,8.93) v1(61.69,10.93) v1(61.69,9.93) v1(61.69,8.93)
MCO_NI: length 20.2
  Top Layer w0.38: CN1.5 24,37.22 23.49,37.72 23.49,46.49 22.73,47.25 U8.4
MCU_VDD: length 32.1
  Bottom Layer w0.38: CN1.2 32,40.52 55.5,40.52 U9.1
RSTN_NI: length 11.1
  Top Layer w0.38: CN1.7 27.56,34.8 U5.1
SW_A0: length 36.3
  Bottom Layer w0.38: U9.3 50.8,30.74 28.96,30.74 27.81,29.6 CN1.11
SW_A1: length 32.7
  Bottom Layer w0.38: U9.4 52.2,29.6 CN1.12
SW_A2: length 35.3
  Bottom Layer w0.38: CN1.13 28.96,28.33 53.47,28.33 U9.5
SW_A3: length 31.7
  Bottom Layer w0.38: CN1.14 54.74,27.06 U9.6
SW_A4: length 34.2
  Bottom Layer w0.38: U9.7 56.01,25.79 28.96,25.79 CN1.15
SW_CS_N: length 30.6
  Bottom Layer w0.38: CN1.16 57.28,24.52 U9.8
SW_EN_N: length 29.6
  Bottom Layer w0.38: U9.10 CN1.18
SW_VDD: length 259.3
  Top Layer w0.38: R24.2 7.03,47.21 v1(6.98,47.25) ; v1(48.58,19.82) 48.2,19.44 U4.8 ; C5.1 9.08,34.8 U5.8 v1(11.3,34.8) ; C1.1 8.95,15.37 U1.8 ; v1(48.67,38.69) 47.78,38.69 47.44,38.36 U6.8 ; v1(48.58,32.14) C2.1 48.2,27.06 U2.8 ; v1(11.43,43.44) U8.8 8.95,43.44 C8.1 ; v1(36.09,37.22) 36.09,37.19 R6.1 36.12,37.14 36.06,37.09 ; v1(8.54,23.02) 8.89,23.37 U7.8 11.27,22.36 11.52,22.1 20.57,22.1 21.21,22.74 v1(21.21,25.91) 21.22,25.93 R7.1 ; v1(21.46,45.98) R8.1 ; v1(53.09,19.82) 53.59,20.32 53.59,22.61 53.04,23.17 R12.2 ; v1(48.58,47.12) 48.2,46.74 U3.8
  Bottom Layer w0.38: U9.2 61.47,43.95 61.47,45.85 60.58,46.74 58.42,46.74 57.28,45.6 57.28,43.95 56.13,42.8 50.12,42.8 v1(50.09,42.84) 49.33,43.6 49.33,46.37 v1(48.58,47.12) ; U9.2 62.81,39.3 62.81,22.81 60.71,20.71 57.66,20.71 56.77,19.82 v1(53.09,19.82) v1(48.58,19.82) 47.94,19.18 47.94,17.15 49.45,15.64 v1(50.09,15.64) ; U9.2 51.14,33.62 ; v1(11.18,15.37) 11.18,14.74 11.56,14.36 21.72,14.36 22.61,15.24 22.61,25.53 22.23,25.91 v1(21.21,25.91) 21.21,32.77 ; v1(48.67,38.69) 49.45,37.91 49.45,35.23 v1(50.21,34.47) 51.05,33.62 51.14,33.62 ; 21.21,32.77 11.94,32.77 11.3,33.41 v1(11.3,34.8) 11.3,37.46 10.09,38.67 v1(7.17,38.67) ; 21.21,32.77 21.21,33.15 21.46,33.41 ; 36.09,32.14 v1(36.09,37.22) ; 36.09,32.14 v1(48.58,32.14) 49.66,32.14 51.14,33.62 ; 36.09,32.14 CN1.10 28.96,33.41 21.46,33.41 ; 21.46,33.41 21.46,41.9 ; 21.46,41.9 12.97,41.9 v1(11.43,43.44) 7.75,43.44 6.98,44.2 v1(6.98,47.25) ; 21.46,41.9 v1(21.46,45.98) ; v1(7.12,19.18) 8.92,20.98 8.92,22.64 v1(8.54,23.02) 7.81,23.75 7.81,26.46 v1(7.05,27.22)
SW_WR_N: length 33.2
  Bottom Layer w0.38: U9.9 58.71,23.41 29.12,23.41 CN1.17
TAI_NI: length 16.6
  Top Layer w0.38: U3.1 34.8,46.74 34.29,46.23 34.29,40.77 33.27,39.76 CN1.4
TAO_NI: length 12.6
  Top Layer w0.38: U6.4 34.67,34.55 34.16,35.06 34.16,36.83 33.78,37.22 CN1.6
TCLK_NI: length 17.5
  Top Layer w0.38: U2.1 34.42,27.06 33.65,27.82 33.65,34.17 33.15,34.68 CN1.8
TDI_NI: length 10.5
  Top Layer w0.38: U4.1 CN1.20
TDO_NI: length 15.3
  Top Layer w0.38: U7.4 19.68,27.18 20.19,27.69 20.19,31.5 20.83,32.14 CN1.9
TSTROBE_NI: length 14.7
  Top Layer w0.38: CN1.19 27.69,16.01 27.05,15.37 U1.1
$1N832: length 3.7
  Top Layer w0.38: R1.2 19.05,17.91 U1.3 U1.2
$1N836: length 3.9
  Top Layer w0.38: R2.2 U2.2 U2.3
$1N843: length 3.9
  Top Layer w0.38: R3.2 40.71,45.45 U3.2 U3.3
$1N857: length 3.8
  Top Layer w0.38: R4.2 38.29,18.17 U4.2 U4.3
$1N862: length 3.9
  Top Layer w0.38: R5.2 19.35,37.34 U5.3 U5.2
$1N867: length 3.9
  Top Layer w0.38: R6.2 38.2,37.09 U6.2 U6.3
$1N875: length 3.8
  Top Layer w0.38: R7.2 19.19,25.91 U7.3 U7.2
$1N1426: length 37.6
  Top Layer w0.38: U1.6 9.39,17.91 8.63,18.67 R10.1 8.63,19.94 8.12,20.45 5.46,20.45 4.45,19.44 4.45,13.47 5.08,12.83 19.81,12.83 21.21,11.43 P1.2
$1N1466: length 32.9
  Top Layer w0.38: U5.6 10.01,37.34 R18.1 8.68,39.59 8.13,40.14 5.46,40.14 4.83,40.77 4.83,49.92 6.1,51.19 15.24,51.19 15.75,51.69 P5.2
$1N1479: length 35
  Top Layer w0.38: P6.2 47.37,52.33 48.51,51.19 52.32,51.19 53.98,49.53 53.98,35.82 51.43,33.28 48.95,33.28 48.7,33.53 R20.1 47.35,35.82 U6.6
$1N1489: length 38.1
  Top Layer w0.38: P7.2 10.67,9.15 10.29,9.53 4.32,9.53 2.67,11.18 2.67,26.93 4.32,28.58 8.04,28.58 8.55,28.07 R22.1 9.86,25.91 U7.6
$1N1503: length 29
  Top Layer w0.38: U8.6 9.02,45.98 8.55,46.44 R24.1 8.55,48.61 9.09,49.15 25.65,49.15 26.29,49.79 P8.2
$1N2683: length 3.9
  Top Layer w0.38: 16.8,44.71 U8.3 R8.2
$1N7494: length 37.9
  Top Layer w0.38: P1.1 26.29,12.58 25.15,13.72 5.84,13.72 5.46,14.1 5.46,17.53 5.84,17.91 8.13,17.91 8.63,17.41 R9.2 U1.7
$1N7701: length 31.1
  Top Layer w0.38: P2.2 42.29,10.93 43.18,11.81 49.78,11.81 52.32,14.36 52.32,21.34 51.94,21.72 49.28,21.72 48.58,22.42 R12.1 48.58,23.8 47.87,24.52 U2.6
$1N7808: length 33.7
  Top Layer w0.38: U2.7 48.57,25.79 R11.2 48.58,25.08 49.15,24.52 54.74,24.52 54.99,24.26 54.99,12.45 53.47,10.93 48.39,10.93 47.37,9.91 P2.1
$1N7842: length 35.2
  Top Layer w0.38: U3.6 47.22,44.2 R14.1 48.58,41.79 48.71,41.66 51.05,41.66 52.07,42.68 52.2,42.68 52.2,48.52 51.43,49.28 37.85,49.28 36.83,50.3 P3.2
$1N7943: length 36.2
  Top Layer w0.38: U3.7 48.56,45.47 R13.2 48.58,44.64 49.02,44.2 50.93,44.2 51.43,44.71 51.43,47.88 50.8,48.52 32.26,48.52 31.75,49.03 P3.1
$1N8036: length 27.8
  Top Layer w0.38: U4.6 47.33,16.9 R16.1 48.58,14.23 48.2,13.85 33.4,13.85 31.75,12.2 P4.2
$1N8041: length 29.5
  Top Layer w0.38: 48.55,18.17 48.55,17.15 48.81,16.9 50.8,16.9 51.43,16.26 51.43,14.74 49.78,13.09 37.97,13.09 36.83,11.94 P4.1 ; 48.55,18.17 R15.2 ; 48.55,18.17 U4.7
$1N8826: length 31
  Top Layer w0.38: R17.2 8.68,36.96 8.3,37.34 5.08,37.34 4.06,38.36 4.06,50.93 5.46,52.33 9.91,52.33 10.67,53.09 P5.1 ; U5.7 8.68,36.07
$1N9060: length 37.9
  Top Layer w0.38: P7.1 15.75,10.04 14.73,11.05 4.45,11.05 3.56,11.94 3.56,23.75 3.68,23.75 5.84,25.91 8,25.91 8.55,25.36 R21.2 8.57,24.64 U7.7
$1N9174: length 30.4
  Top Layer w0.38: 11.39,44.71 8.58,44.71 R23.2 8.55,45.17 7.75,45.98 6.1,45.98 5.59,46.49 5.59,48.9 6.6,49.92 20.45,49.92 21.34,50.8 21.34,55.25 P8.1
$1N9186: length 35.7
  Top Layer w0.38: P6.1 42.29,51.19 43.31,50.17 51.82,50.17 52.96,49.03 52.96,37.85 50.93,35.82 48.9,35.82 48.65,36.07 R19.2 U6.7

## Copper pours and planes (outline as drawn; the poured copper is in the pictures)
GND on Top Layer: 0,61.72 64,61.72 64,0 0,0
GND on Bottom Layer: 0,61.72 64,61.72 64,0 0,0

## Text on the board
Top Silkscreen Layer: RSTN_B | TDO_A | RSTN_A | TDO_B | MCO_B | TST_A | MCO_A | TST_B | TDI_A | TAI_B | TAI_A | TDI_B | TCLK_A | TAO_B | TCLK_B | TAO_A | SW_WR_N | SW_EN_N | SW_CS_N | MCU_VDD | SW_VDD | SW_A0 | SW_A2 | SW_A3 | SW_A4 | SW_A1 | GND | 485测试转接板 / MCU端

# Board PCB2
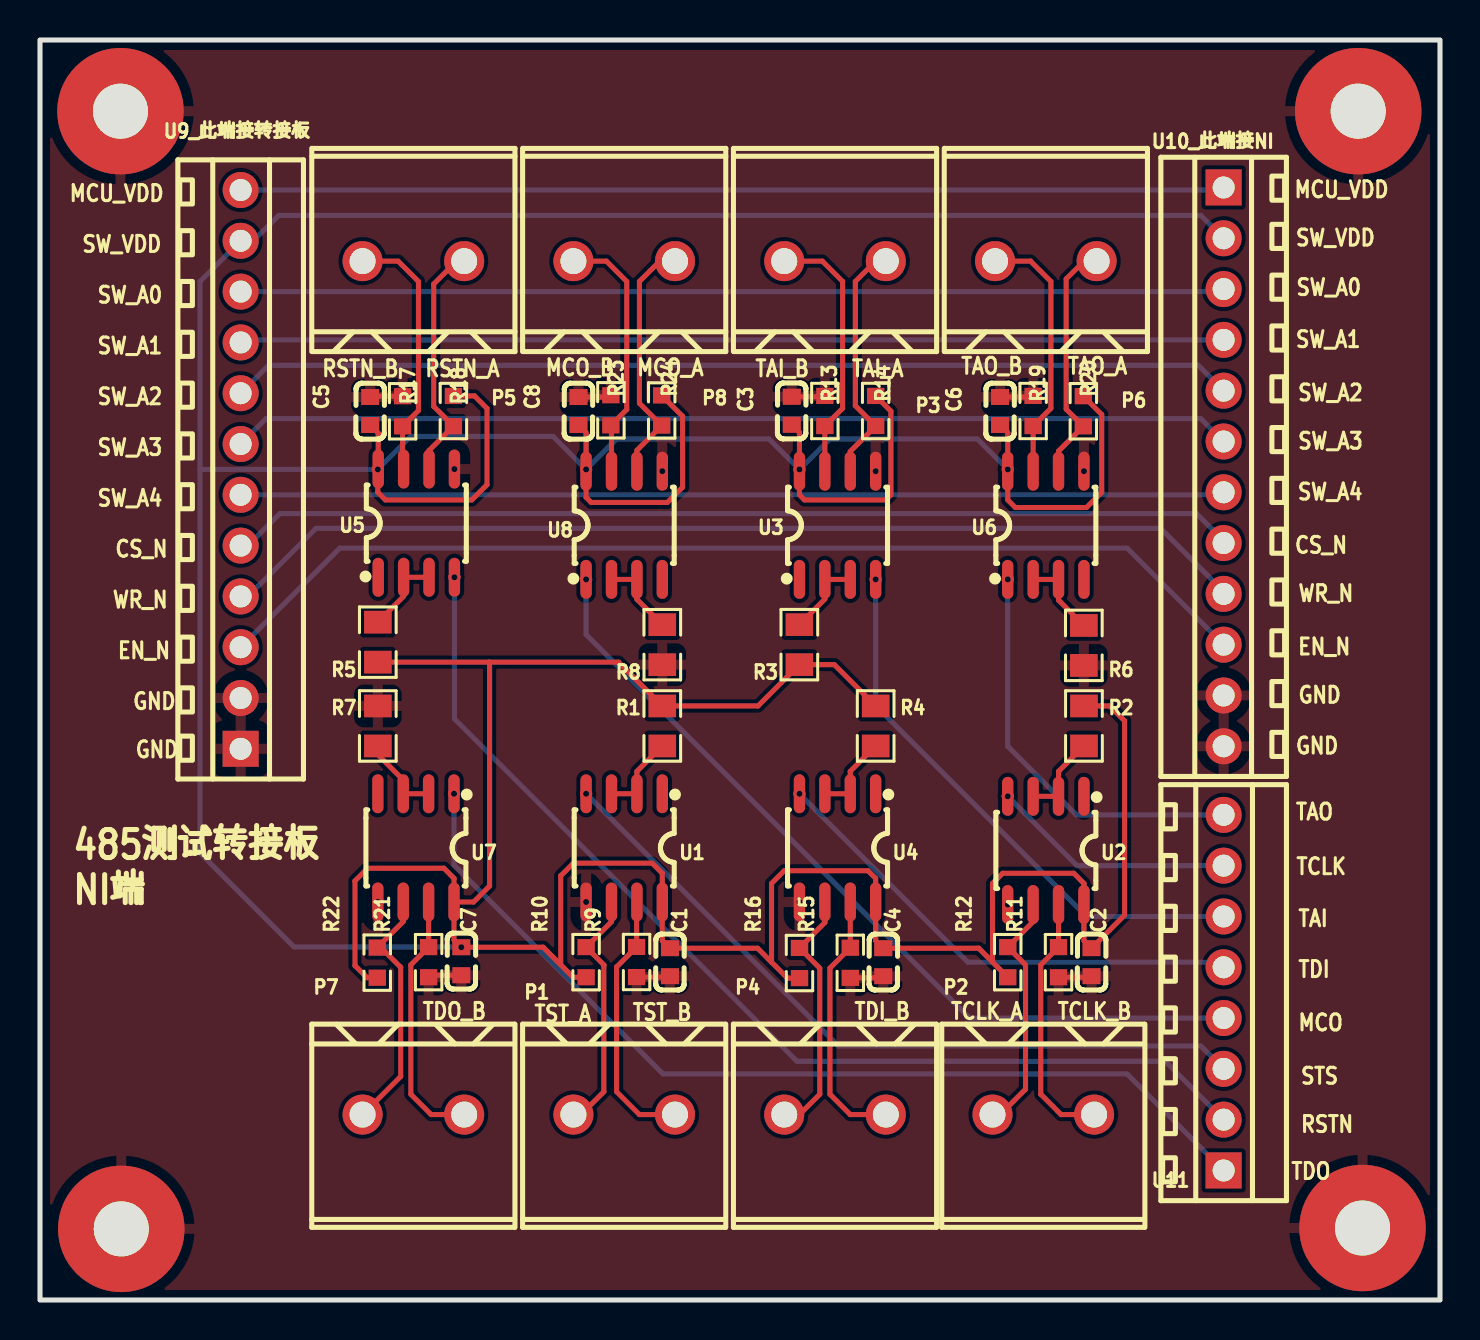
[diagram p4: board, top side]
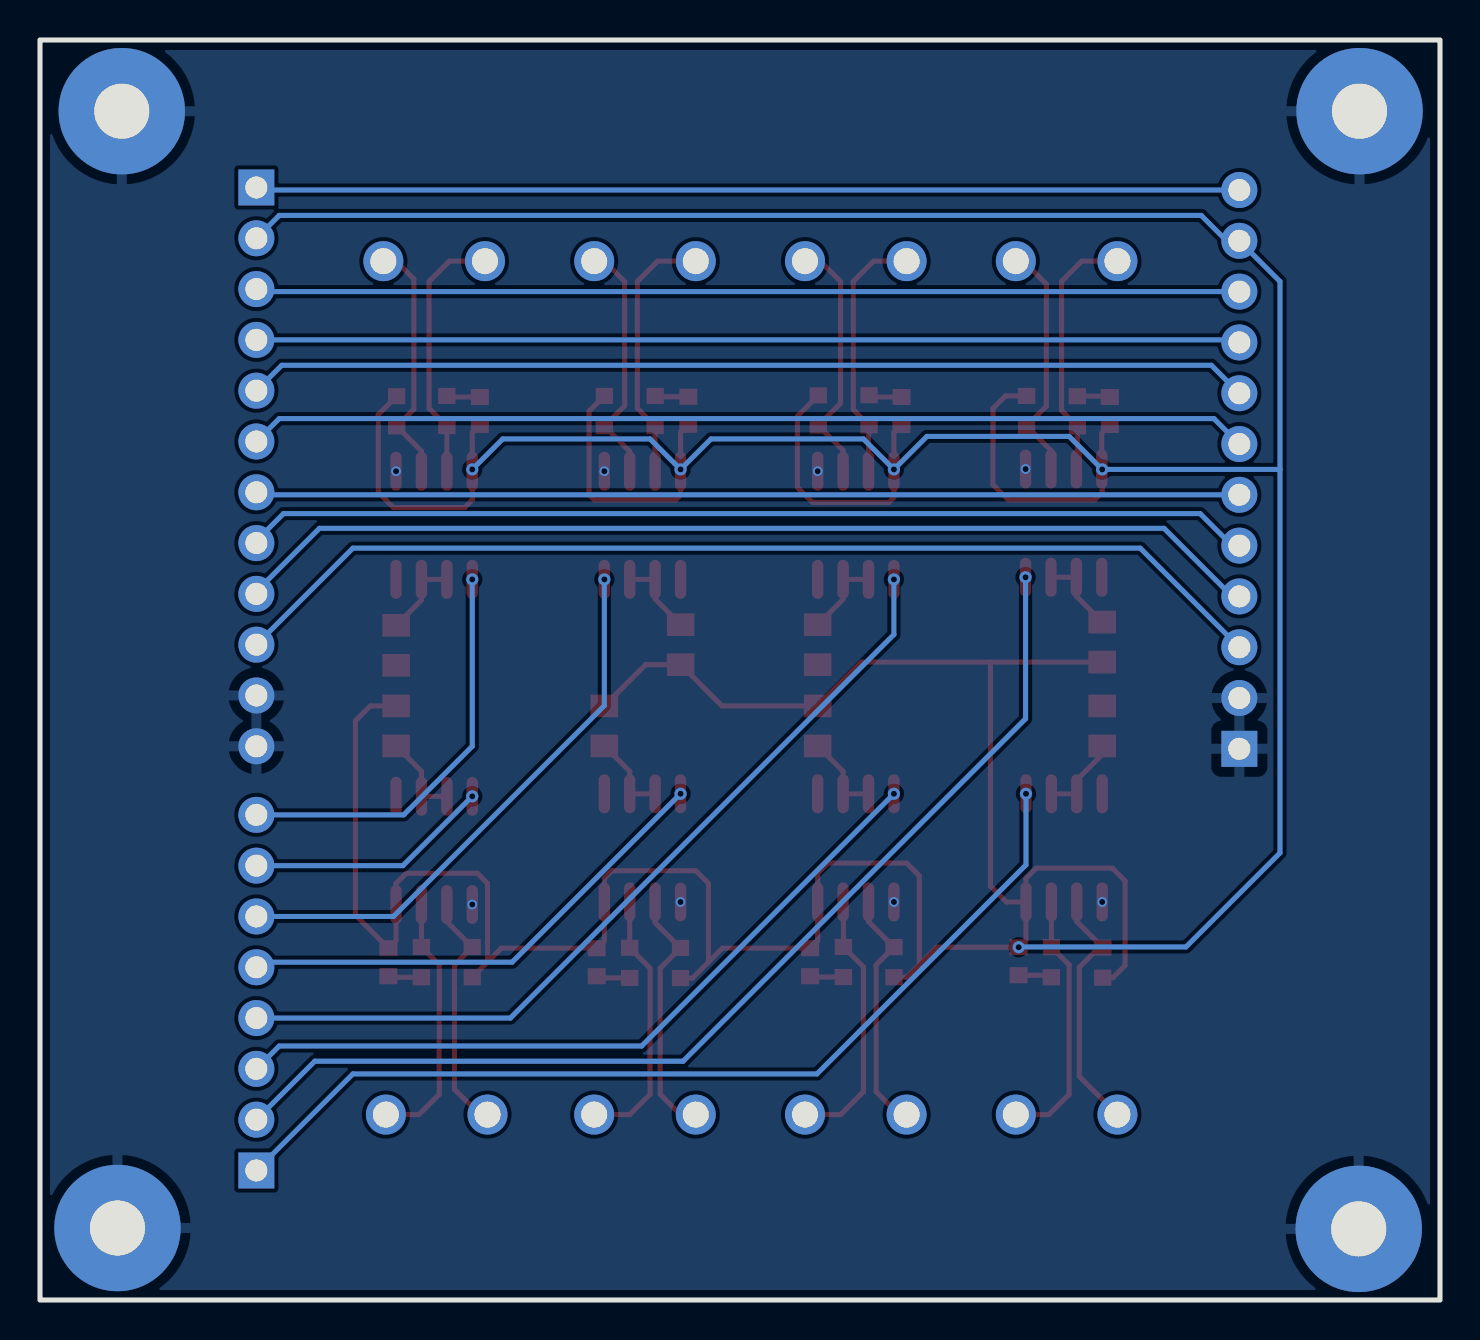
[diagram p5: board, bottom side, seen from below]

Outline 70 x 63 mm; copper layers: Top Layer, Bottom Layer. Coordinates in mm from the lower left corner of the outline.
Outline path: rectangle 0,63 70,0
Stack: Top Layer 0.035mm / Dielectric1 1.51mm FR4 er 4.5 / Bottom Layer 0.035mm

## Design rules (mm)
template: 自定义配置
spacing copperThickness1oz (default): track to track 0.102, other pairs 0.152 to 0.3
spacing copperThickness2oz: track to track 0.203, other pairs 0.152 to 0.3
track width copperThickness1oz (default): min 0.127, default 0.254, max 2.54
track width copperThickness2oz: min 0.203, default 0.254, max 2.54
differential pair differentialPair (default): width min 0.127, default 0.254, max 2.54; gap min 0.152, default 0.152
via viaSize (default): diameter min 0.5, default 0.61, max 10; hole min 0.3, default 0.305, max 6.3

## Placement (name value [footprint] x y rotation side)
C1  10uF  [C0603]  31.5 16.89 270 top
C2  10uF  [C0603]  52.58 16.89 270 top
C3  10uF  [C0603]  37.59 44.46 90 top
C4  10uF  [C0603]  42.16 16.89 270 top
C5  10uF  [C0603]  16.51 44.45 90 top
C6  10uF  [C0603]  48.01 44.45 90 top
C7  10uF  [C0603]  21.07 16.94 270 top
C8  10uF  [C0603]  26.92 44.45 90 top
J1  -  [demo板安装孔]  65.91 59.44 0 top
J2  -  [demo板安装孔]  4.02 59.44 0 top
J3  -  [demo板安装孔]  4.06 3.56 0 top
J4  -  [demo板安装孔]  66.13 3.6 0 top
P1  WJ500V-5.08-2P  [CONN-TH_2P-P5.00_WJ500V-5.08-2P]  29.21 9.27 180 top
P2  WJ500V-5.08-2P  [CONN-TH_2P-P5.00_WJ500V-5.08-2P]  50.16 9.27 180 top
P3  WJ500V-5.08-2P  [CONN-TH_2P-P5.00_WJ500V-5.08-2P]  39.75 51.94 0 top
P4  WJ500V-5.08-2P  [CONN-TH_2P-P5.00_WJ500V-5.08-2P]  39.75 9.27 180 top
P5  WJ500V-5.08-2P  [CONN-TH_2P-P5.00_WJ500V-5.08-2P]  18.67 51.94 0 top
P6  WJ500V-5.08-2P  [CONN-TH_2P-P5.00_WJ500V-5.08-2P]  50.29 51.94 0 top
P7  WJ500V-5.08-2P  [CONN-TH_2P-P5.00_WJ500V-5.08-2P]  18.67 9.27 180 top
P8  WJ500V-5.08-2P  [CONN-TH_2P-P5.00_WJ500V-5.08-2P]  29.21 51.94 0 top
R1  4.7kΩ  [R0805]  31.12 28.7 270 top
R2  4.7kΩ  [R0805]  52.2 28.7 270 top
R3  4.7kΩ  [R0805]  37.97 32.77 90 top
R4  4.7kΩ  [R0805]  41.78 28.7 270 top
R5  4.7kΩ  [R0805]  16.89 32.89 90 top
R6  4.7kΩ  [R0805]  52.19 32.73 90 top
R7  4.7kΩ  [R0805]  16.89 28.7 270 top
R8  4.7kΩ  [R0805]  31.12 32.77 90 top
R9  360Ω  [R0603]  29.83 16.9 90 top
R10  360Ω  [R0603]  27.31 16.89 270 top
R11  360Ω  [R0603]  50.93 16.89 90 top
R12  360Ω  [R0603]  48.39 16.89 270 top
R13  360Ω  [R0603]  39.24 44.45 270 top
R14  360Ω  [R0603]  41.78 44.45 90 top
R15  360Ω  [R0603]  40.51 16.86 90 top
R16  360Ω  [R0603]  37.97 16.85 270 top
R17  360Ω  [R0603]  18.13 44.44 270 top
R18  360Ω  [R0603]  20.67 44.45 90 top
R19  360Ω  [R0603]  49.66 44.45 270 top
R20  360Ω  [R0603]  52.17 44.44 90 top
R21  360Ω  [R0603]  19.43 16.89 90 top
R22  360Ω  [R0603]  16.86 16.87 270 top
R23  360Ω  [R0603]  28.55 44.49 270 top
R24  360Ω  [R0603]  31.09 44.48 90 top
U1  SP485EEN-L/TR  [SOIC-8_L5.0-W4.0-P1.27-LS6.0-BL]  29.21 22.61 180 top
U2  SP485EEN-L/TR  [SOIC-8_L5.0-W4.0-P1.27-LS6.0-BL]  50.29 22.48 180 top
U3  SP485EEN-L/TR  [SOIC-8_L5.0-W4.0-P1.27-LS6.0-BL]  39.88 38.73 0 top
U4  SP485EEN-L/TR  [SOIC-8_L5.0-W4.0-P1.27-LS6.0-BL]  39.88 22.61 180 top
U5  SP485EEN-L/TR  [SOIC-8_L5.0-W4.0-P1.27-LS6.0-BL]  18.82 38.84 0 top
U6  SP485EEN-L/TR  [SOIC-8_L5.0-W4.0-P1.27-LS6.0-BL]  50.29 38.73 0 top
U7  SP485EEN-L/TR  [SOIC-8_L5.0-W4.0-P1.27-LS6.0-BL]  18.8 22.61 180 top
U8  SP485EEN-L/TR  [SOIC-8_L5.0-W4.0-P1.27-LS6.0-BL]  29.21 38.73 0 top
U9_此端接转接板  DB125-2.54-12P-GN-S  [CONN-TH_DB125-2.54-12P-GN]  10.03 41.53 90 top
U10_此端接NI  DB125-2.54-12P-GN-S  [CONN-TH_DB125-2.54-12P-GN]  59.18 41.66 270 top
U11  DB125-2.54-8P-GN-S  [CONN-TH_DB125-2.54-8P-GN]  59.18 15.37 90 top

## Footprints (pads in the part's own frame, mm; a bottom-side part is the same pattern mirrored in y, then rotated)
C0603
  rect 0.8x0.9 smd: 1(-0.7,0) 2(0.7,0)
CONN-TH_2P-P5.00_WJ500V-5.08-2P
  round 2 hole 1.3: 1(-2.54,0) 2(2.54,0)
CONN-TH_DB125-2.54-8P-GN
  rect 1.8x1.8 hole 1.1: 1(-8.89,0)
  round 1.8 hole 1.1: 2(-6.35,0) 3(-3.81,0) 4(-1.27,0) 5(1.27,0) 6(3.81,0) 7(6.35,0) 8(8.89,0)
CONN-TH_DB125-2.54-12P-GN
  rect 1.8x1.8 hole 1.1: 1(-13.97,0)
  round 1.8 hole 1.1: 2(-11.43,0) 3(-8.89,0) 4(-6.35,0) 5(-3.81,0) 6(-1.27,0) 7(1.27,0) 8(3.81,0) 9(6.35,0) 10(8.89,0) 11(11.43,0) 12(13.97,0)
demo板安装孔
  round 6.32 hole 2.75: 1(0,0)
R0603
  rect 0.806x0.864 smd: 1(-0.753,0) 2(0.753,0)
R0805
  rect 1.133x1.377 smd: 1(-1,0) 2(1,0)
SOIC-8_L5.0-W4.0-P1.27-LS6.0-BL
  oval 0.569x1.95 smd: 1(-1.905,-2.705) 2(-0.635,-2.705) 3(0.635,-2.705) 4(1.905,-2.705) 5(1.905,2.705) 6(0.635,2.705) 7(-0.635,2.705) 8(-1.905,2.705)

## Nets
GND: C1.2 C2.2 C3.2 C4.2 C5.2 C6.2 C7.2 C8.2 J1.1 J2.1 J3.1 J4.1 R6.1 R7.1 R8.1 R9.1 R11.1 R13.1 R15.1 R17.1 R19.1 R21.1 R23.1 U1.5 U2.5 U3.5 U4.5 U5.5 U6.5 U7.5 U8.5 U9_此端接转接板.1 U9_此端接转接板.2 U10_此端接NI.11 U10_此端接NI.12
MCO_NI: U8.1 U11.4
MCU_VDD: U9_此端接转接板.12 U10_此端接NI.1
RSTN_NI: U5.4 U11.2
SW_A0: U9_此端接转接板.10 U10_此端接NI.3
SW_A1: U9_此端接转接板.9 U10_此端接NI.4
SW_A2: U9_此端接转接板.8 U10_此端接NI.5
SW_A3: U9_此端接转接板.7 U10_此端接NI.6
SW_A4: U9_此端接转接板.6 U10_此端接NI.7
SW_CS_N: U9_此端接转接板.5 U10_此端接NI.8
SW_EN_N: U9_此端接转接板.3 U10_此端接NI.10
SW_VDD: C1.1 C2.1 C3.1 C4.1 C5.1 C6.1 C7.1 C8.1 R1.1 R2.1 R3.1 R4.1 R5.1 R10.2 R12.2 R14.2 R16.2 R18.2 R20.2 R22.2 R24.2 U1.8 U2.8 U3.8 U4.8 U5.8 U6.8 U7.8 U8.8 U9_此端接转接板.11 U10_此端接NI.2
SW_WR_N: U9_此端接转接板.4 U10_此端接NI.9
TAI_NI: U3.4 U11.6
TAO_NI: U6.1 U11.8
TCLK_NI: U2.4 U11.7
TDI_NI: U4.4 U11.5
TDO_NI: U7.1 U11.1
TSTROBE_NI: U1.4 U11.3
$1N12065: R1.2 U1.2 U1.3
$1N12066: R2.2 U2.2 U2.3
$1N12067: R3.2 U3.2 U3.3
$1N12068: R4.2 U4.2 U4.3
$1N12069: R6.2 U6.2 U6.3
$1N12070: R7.2 U7.2 U7.3
$1N12071: P6.2 R20.1 U6.6
$1N12074: P7.2 R22.1 U7.6
$1N12077: P8.2 R24.1 U8.6
$1N12080: R8.2 U8.2 U8.3
$1N12109: P1.1 R9.2 U1.7
$1N12117: P1.2 R10.1 U1.6
$1N12129: P2.2 R12.1 U2.6
$1N12137: P2.1 R11.2 U2.7
$1N12145: P3.2 R14.1 U3.6
$1N12153: P3.1 R13.2 U3.7
$1N12161: P5.2 R18.1 U5.6
$1N12164: R5.2 U5.2 U5.3
$1N12169: P4.2 R16.1 U4.6
$1N12172: P4.1 R15.2 U4.7
$1N12187: P5.1 R17.2 U5.7
$1N12210: P7.1 R21.2 U7.7
$1N12222: P8.1 R23.2 U8.7
$1N12229: P6.1 R19.2 U6.7

Pads without a net: U1 1; U2 1; U3 1; U4 1; U5 1; U6 4; U7 4; U8 4

## Via types
v1: diameter 0.61, hole 0.305, Top Layer to Bottom Layer, 13 vias
v2: diameter 0.5, hole 0.305, Top Layer to Bottom Layer, 8 vias

## Routing (per net, layer and track width the routed paths; a pad name or vN(x,y) marks a point on that pad's centre or on a via; arc(x,y) is an arc through that point)
GND: length 13.4
  Top Layer w0.254: C8.2 28.46,45.15 R23.1 ; C3.2 39.2,45.16 R13.1 ; R21.1 19.53,16.24 C7.2 ; R17.1 16.55,45.19 C5.2 ; R19.1 49.6,45.15 C6.2 ; C4.2 42.08,16.1 R15.1 ; R11.1 52.52,16.14 C2.2 ; C1.2 31.45,16.15 29.83,16.15
  vias: v2(16.89,19.9) v2(20.72,41.55) v2(27.31,19.9) v2(31.12,41.44) v2(37.97,19.9) v2(41.78,41.44) v2(48.39,19.77) v2(52.2,41.44)
MCO_NI: length 42.6
  Bottom Layer w0.254: U11.4 46.48,14.1 27.31,33.27 v1(27.31,36.03)
MCU_VDD: length 49.2
  Bottom Layer w0.254: U10_此端接NI.1 59.06,55.5 U9_此端接转接板.12
RSTN_NI: length 53.8
  Bottom Layer w0.254: U11.2 56.26,11.94 37.85,11.94 20.72,29.06 v1(20.72,36.14)
SW_A0: length 49.2
  Bottom Layer w0.254: U10_此端接NI.3 59.06,50.42 U9_此端接转接板.10
SW_A1: length 49.2
  Bottom Layer w0.254: U10_此端接NI.4 10.16,48.01 U9_此端接转接板.9
SW_A2: length 50.3
  Bottom Layer w0.254: U10_此端接NI.5 57.91,46.74 11.43,46.74 U9_此端接转接板.8
SW_A3: length 50.1
  Bottom Layer w0.254: U10_此端接NI.6 58.04,44.07 11.3,44.07 U9_此端接转接板.7
SW_A4: length 49.2
  Bottom Layer w0.254: U9_此端接转接板.6 59.06,40.26 U10_此端接NI.7
SW_CS_N: length 50.5
  Bottom Layer w0.254: U9_此端接转接板.5 10.39,37.72 11.99,39.32 57.83,39.32 59.18,37.96 U10_此端接NI.8
SW_EN_N: length 53.2
  Bottom Layer w0.254: U9_此端接转接板.3 14.99,37.59 54.36,37.59 U10_此端接NI.10
SW_VDD: length 328.1
  Top Layer w0.254: 47.62,16.9 R12.2 ; 47.62,16.9 47.62,20.83 48.13,21.34 51.69,21.34 52.2,20.83 U2.8 52.2,17.97 C2.1 54.23,19.24 54.23,28.96 53.48,29.7 R2.1 ; 47.62,16.9 46.93,17.59 C4.1 41.78,17.97 U4.8 41.78,21.08 41.4,21.46 37.21,21.46 36.58,20.83 36.58,16.89 ; R4.1 39.72,31.77 R3.1 35.9,29.7 R1.1 28.92,31.89 22.46,31.89 ; U7.8 21.68,19.9 22.48,20.7 22.48,31.87 22.46,31.89 ; U7.8 20.7,21.08 20.19,21.59 16.38,21.59 15.75,20.95 15.75,16.72 16.35,16.12 R22.2 ; U7.8 20.7,18 v1(21.07,17.64) 25.16,17.64 26.03,16.76 ; R18.2 21.73,45.2 22.35,44.58 22.35,40.77 21.59,40 17.27,40 16.89,40.39 v1(16.89,41.53) 16.89,41.53 U5.8 16.91,43.35 C5.1 ; 26.03,16.76 26.03,21.21 26.67,21.84 30.61,21.84 31.12,21.34 U1.8 31.12,17.97 C1.1 35.88,17.59 36.58,16.89 ; 26.03,16.76 26.66,16.14 R10.2 ; R24.2 32.13,44.18 32.13,40.64 31.37,39.88 27.56,39.88 27.31,40.13 U8.8 27.31,43.37 C8.1 ; C3.1 37.97,43.38 U3.8 37.97,40.26 38.23,40 42.29,40 42.54,40.26 42.54,44.44 R14.2 ; 36.58,16.89 37.37,16.09 R16.2 ; 22.46,31.89 R5.1 ; R20.2 53.09,44.27 53.09,40.39 52.32,39.62 48.77,39.62 48.39,40 U6.8 48.39,43.37 C6.1
  Bottom Layer w0.254: 8,41.53 v1(16.89,41.53) 18.54,43.18 25.65,43.18 v1(27.31,41.53) 28.83,43.05 36.45,43.05 v1(37.97,41.53) 39.5,43.05 46.86,43.05 v1(48.39,41.53) ; 8,41.53 8,22.35 12.7,17.65 20.95,17.65 ; 8,41.53 8,50.93 U9_此端接转接板.11 10.67,52.96 11.94,54.23 58.04,54.23 U10_此端接NI.2
SW_WR_N: length 52
  Bottom Layer w0.254: U10_此端接NI.9 59.18,35.43 56.03,38.58 13.8,38.58 10.39,35.18 U9_此端接转接板.4
TAI_NI: length 28.1
  Bottom Layer w0.254: U11.6 52.32,19.18 41.78,29.72 v1(41.78,36.03)
TAO_NI: length 20.6
  Bottom Layer w0.254: v1(48.39,36.03) 48.39,27.69 51.82,24.26 U11.8
TCLK_NI: length 12.2
  Bottom Layer w0.254: v1(48.39,25.18) 51.85,21.72 U11.7
TDI_NI: length 24.8
  Bottom Layer w0.254: U11.5 58.93,16.89 46.39,16.89 v1(37.97,25.31)
TDO_NI: length 48.4
  Bottom Layer w0.254: U11.1 54.36,11.3 31.15,11.3 20.7,21.75 v1(20.7,25.31)
TSTROBE_NI: length 37.6
  Bottom Layer w0.254: v1(27.31,25.31) 39.92,12.7 58.04,12.7 U11.3
$1N12065: length 4.2
  Top Layer w0.254: U1.3 U1.2 29.84,26.43 R1.2
$1N12066: length 4.3
  Top Layer w0.254: R2.2 50.93,26.43 U2.2 U2.3
$1N12067: length 4.1
  Top Layer w0.254: R3.2 39.24,35.04 U3.2 U3.3
$1N12068: length 4.2
  Top Layer w0.254: R4.2 40.51,26.43 U4.2 U4.3
$1N12069: length 4.1
  Top Layer w0.254: R6.2 50.93,35 U6.3 U6.2
$1N12070: length 4.2
  Top Layer w0.254: R7.2 16.89,27.27 18.16,26 U7.3 U7.2
$1N12071: length 12.4
  Top Layer w0.254: U6.6 50.93,42.44 R20.1 51.31,44.54 51.31,51.05 52.2,51.94 P6.2
$1N12074: length 12.6
  Top Layer w0.254: P7.2 18.03,11.18 18.03,16.64 17.05,17.62 R22.1 18.16,18.92 U7.6
$1N12077: length 12.7
  Top Layer w0.254: P8.2 30.99,51.94 29.97,50.93 29.97,44.84 R24.1 29.84,42.48 U8.6
$1N12080: length 4.1
  Top Layer w0.254: R8.2 29.84,35.04 U8.3 U8.2
$1N12109: length 13.3
  Top Layer w0.254: U1.7 29.83,19.88 R9.2 28.83,16.65 28.83,10.41 29.97,9.27 P1.1
$1N12117: length 12.4
  Top Layer w0.254: U1.6 28.57,18.91 R10.1 28.19,16.76 28.19,10.41 27.05,9.27 P1.2
$1N12129: length 12.2
  Top Layer w0.254: 47.62,9.52 48.26,9.52 49.28,10.54 49.28,16.76 R12.1 49.66,18.91 U2.6
$1N12137: length 13.1
  Top Layer w0.254: 52.83,9.27 51.05,9.27 50.04,10.29 50.04,16.76 R11.2 U2.7
$1N12145: length 12.4
  Top Layer w0.254: U3.6 40.51,42.43 R14.1 40.77,44.71 40.77,50.93 41.78,51.94 P3.2
$1N12153: length 13.2
  Top Layer w0.254: U3.7 R13.2 40.13,44.59 40.13,50.93 39.12,51.94 P3.1
$1N12161: length 12.2
  Top Layer w0.254: U5.6 19.45,42.47 20.67,43.69 19.69,44.68 19.69,50.8 20.83,51.94 P5.2
$1N12164: length 4
  Top Layer w0.254: R5.2 18.18,35.18 U5.2 U5.3
$1N12169: length 12.8
  Top Layer w0.254: P4.2 37.97,9.27 38.99,10.29 38.99,16.59 R16.1 39.24,18.87 U4.6
$1N12172: length 13.2
  Top Layer w0.254: 40.51,19.9 R15.2 39.5,16.59 39.5,10.29 40.51,9.27 P4.1
$1N12187: length 12.9
  Top Layer w0.254: P5.1 17.91,51.94 18.92,50.93 18.92,44.47 R17.2 18.13,41.6 U5.7
$1N12210: length 13.1
  Top Layer w0.254: P7.1 19.56,9.27 18.54,10.29 18.54,16.76 R21.2 U7.7
$1N12222: length 12.9
  Top Layer w0.254: U8.7 28.57,43.7 R23.2 29.34,44.52 29.34,50.93 28.32,51.94 P8.1
$1N12229: length 13.1
  Top Layer w0.254: P6.1 49.53,51.94 50.55,50.93 50.55,44.59 R19.2 U6.7

## Copper pours and planes (outline as drawn; the poured copper is in the pictures)
GND on Top Layer: 0,63 70,63 70,0 0,0
GND on Bottom Layer: 0,63 70,63 70,0 0,0

## Text on the board
Top Silkscreen Layer: MCU_VDD | SW_VDD | SW_A0 | SW_A1 | SW_A2 | SW_A3 | SW_A4 | WR_N | CS_N | EN_N | GND | TDO | TAO | TCLK | TAI | TDI | MCO | STS | RSTN | RSTN_B | TDO_B | RSTN_A | TST_A | MCO_B | TST_B | MCO_A | TAI_B | TAI_A | TDI_B | TCLK_A | TAO_B | TCLK_B | TAO_A | 485测试转接板 / NI端
